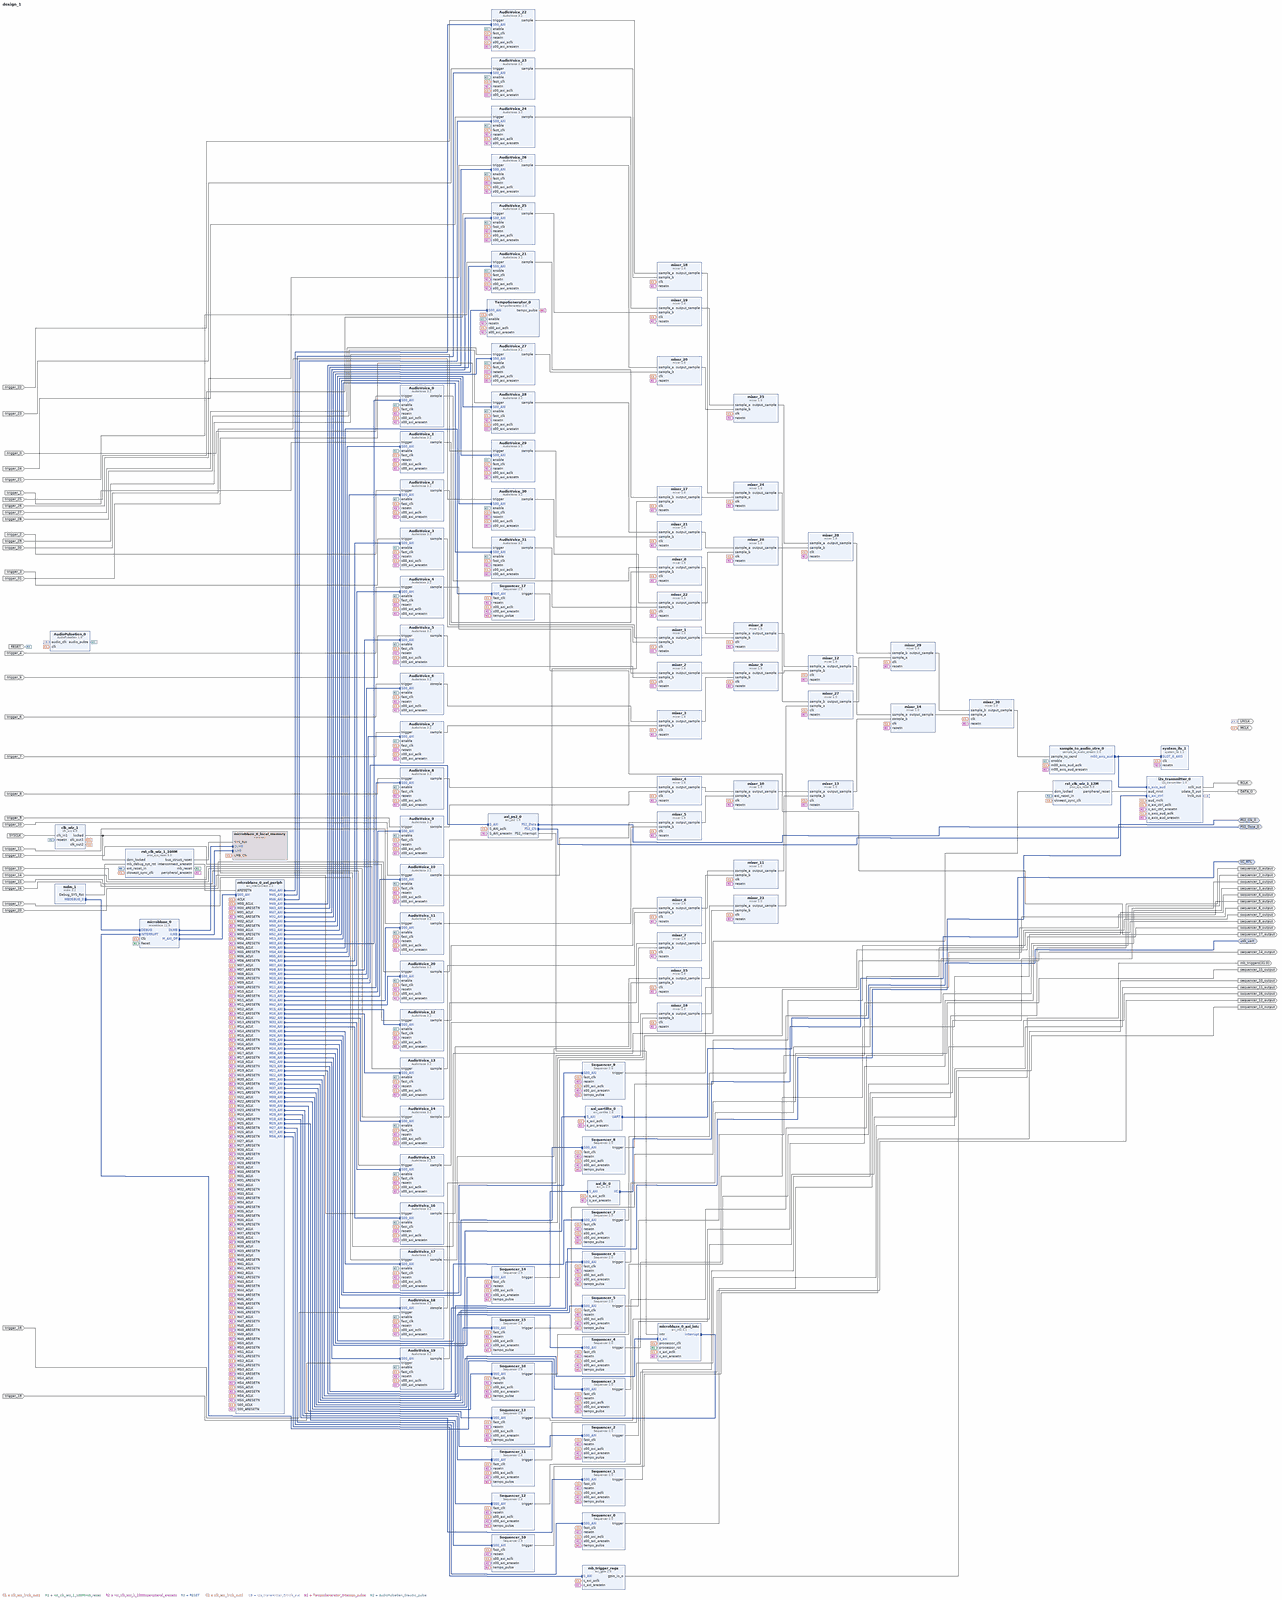
[diagram p0: block diagram of the top level, whole]
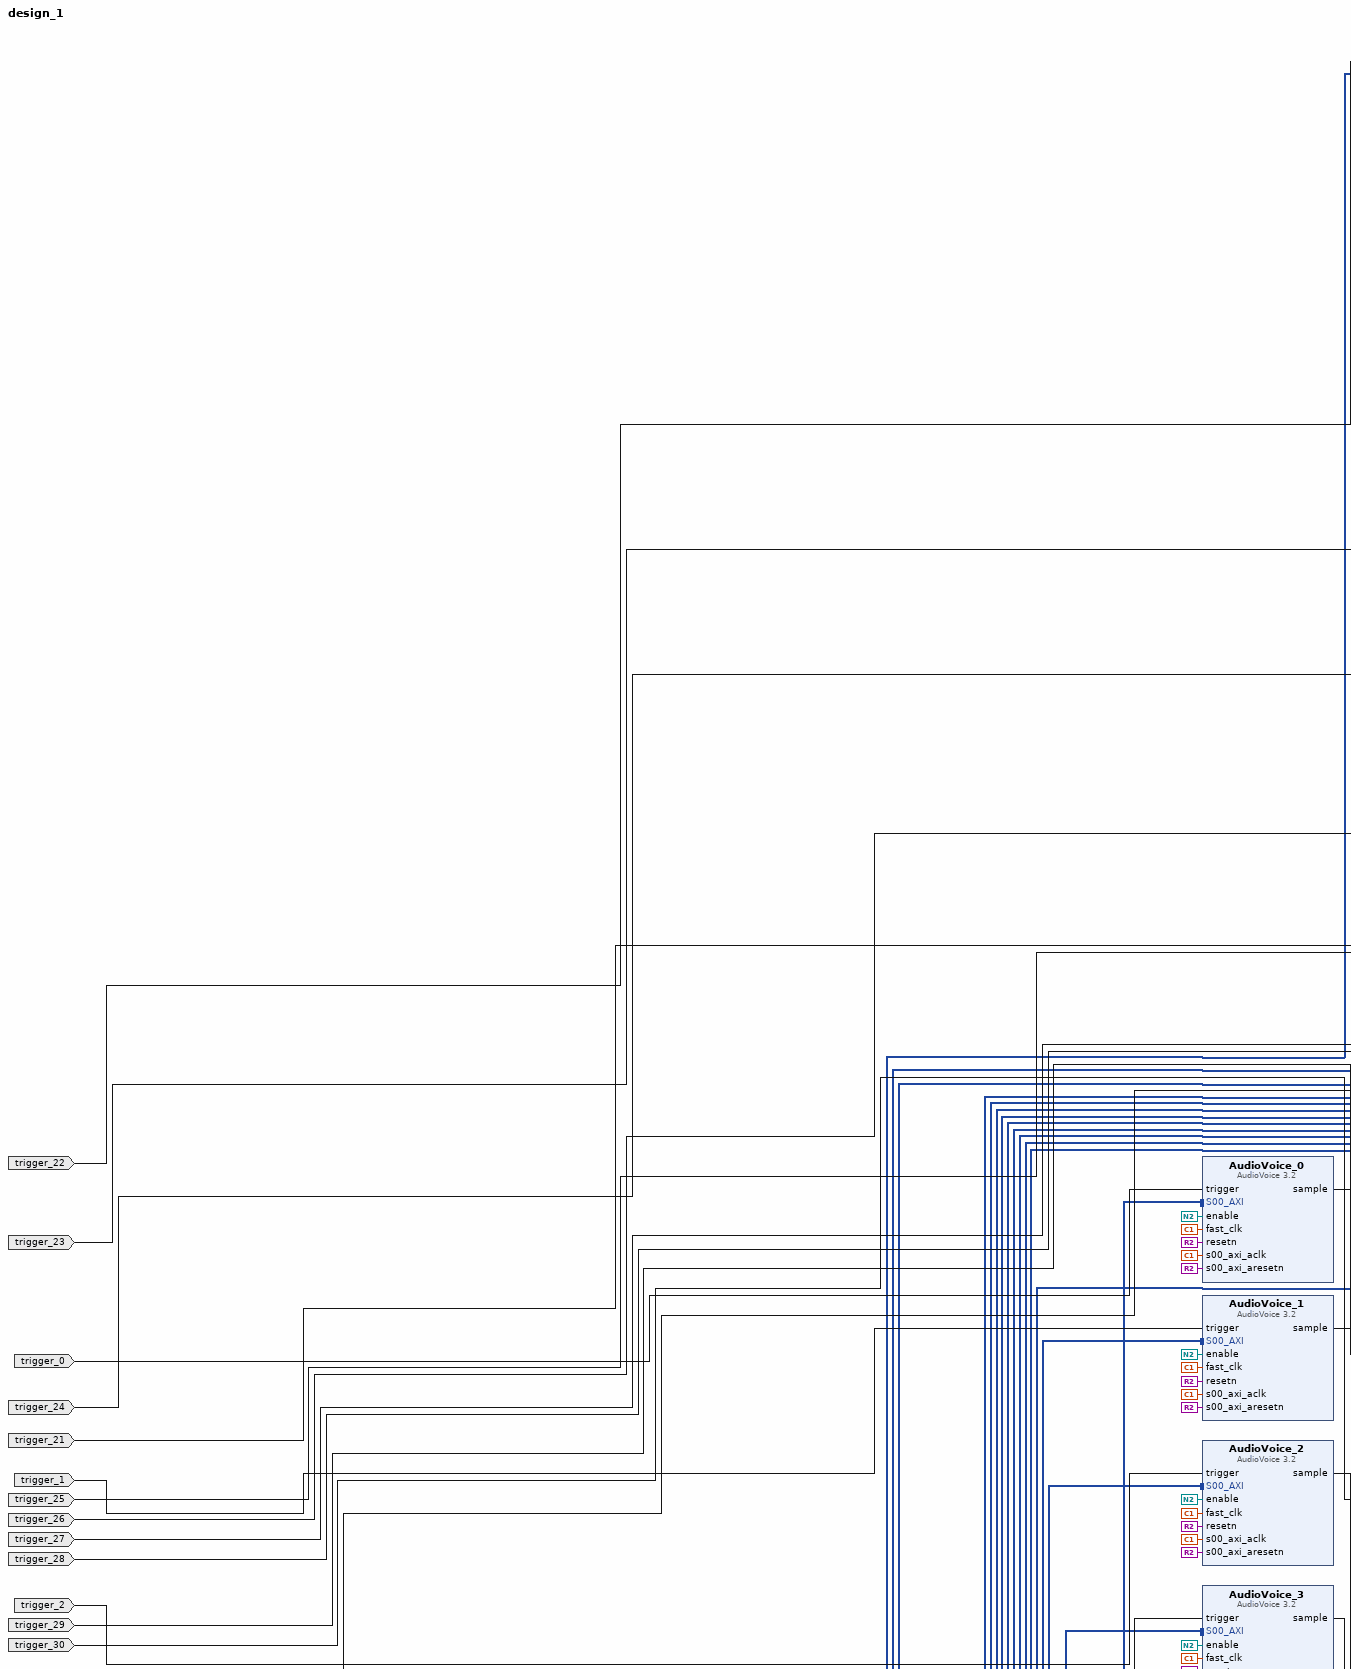
[diagram p1: block diagram of the top level, upper left part]
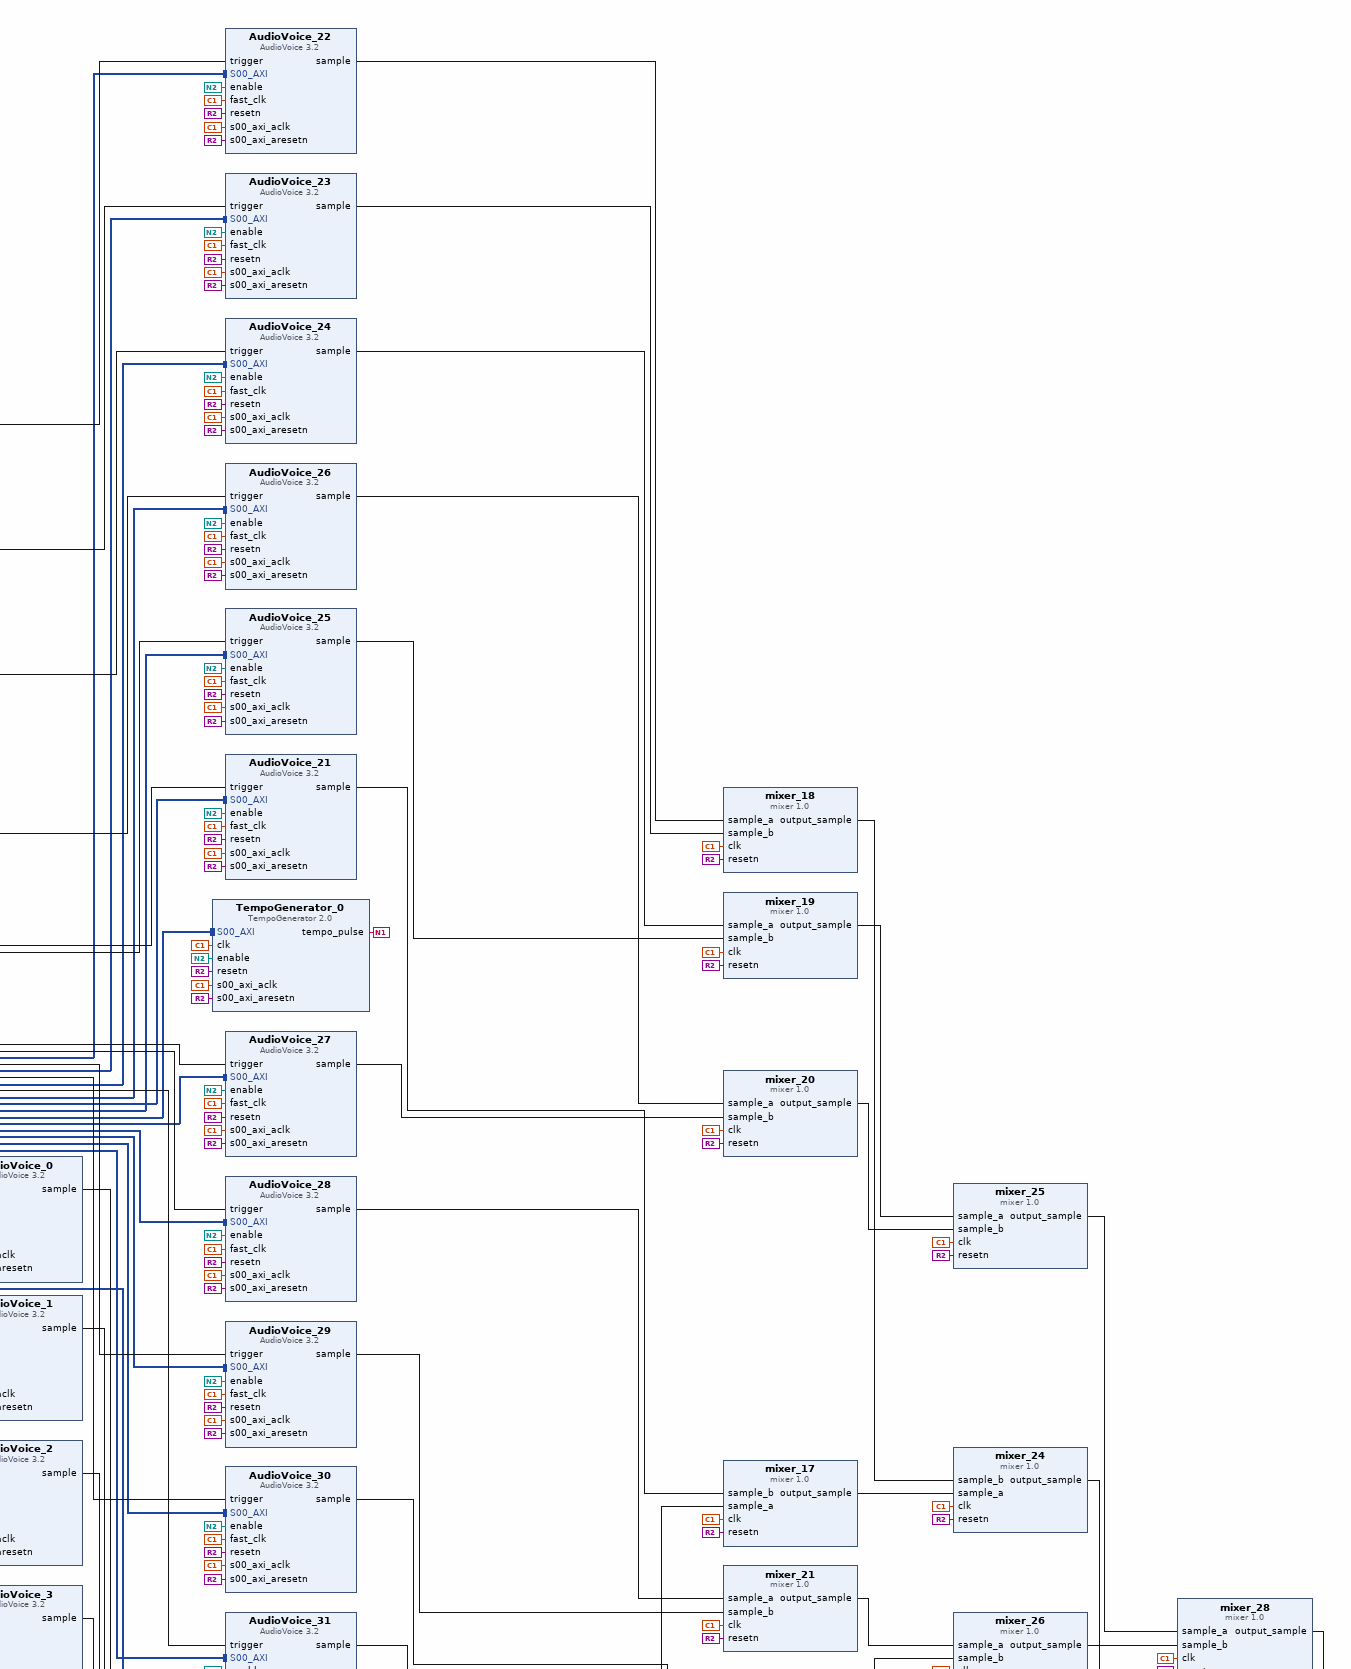
[diagram p2: block diagram of the top level, upper centre part]
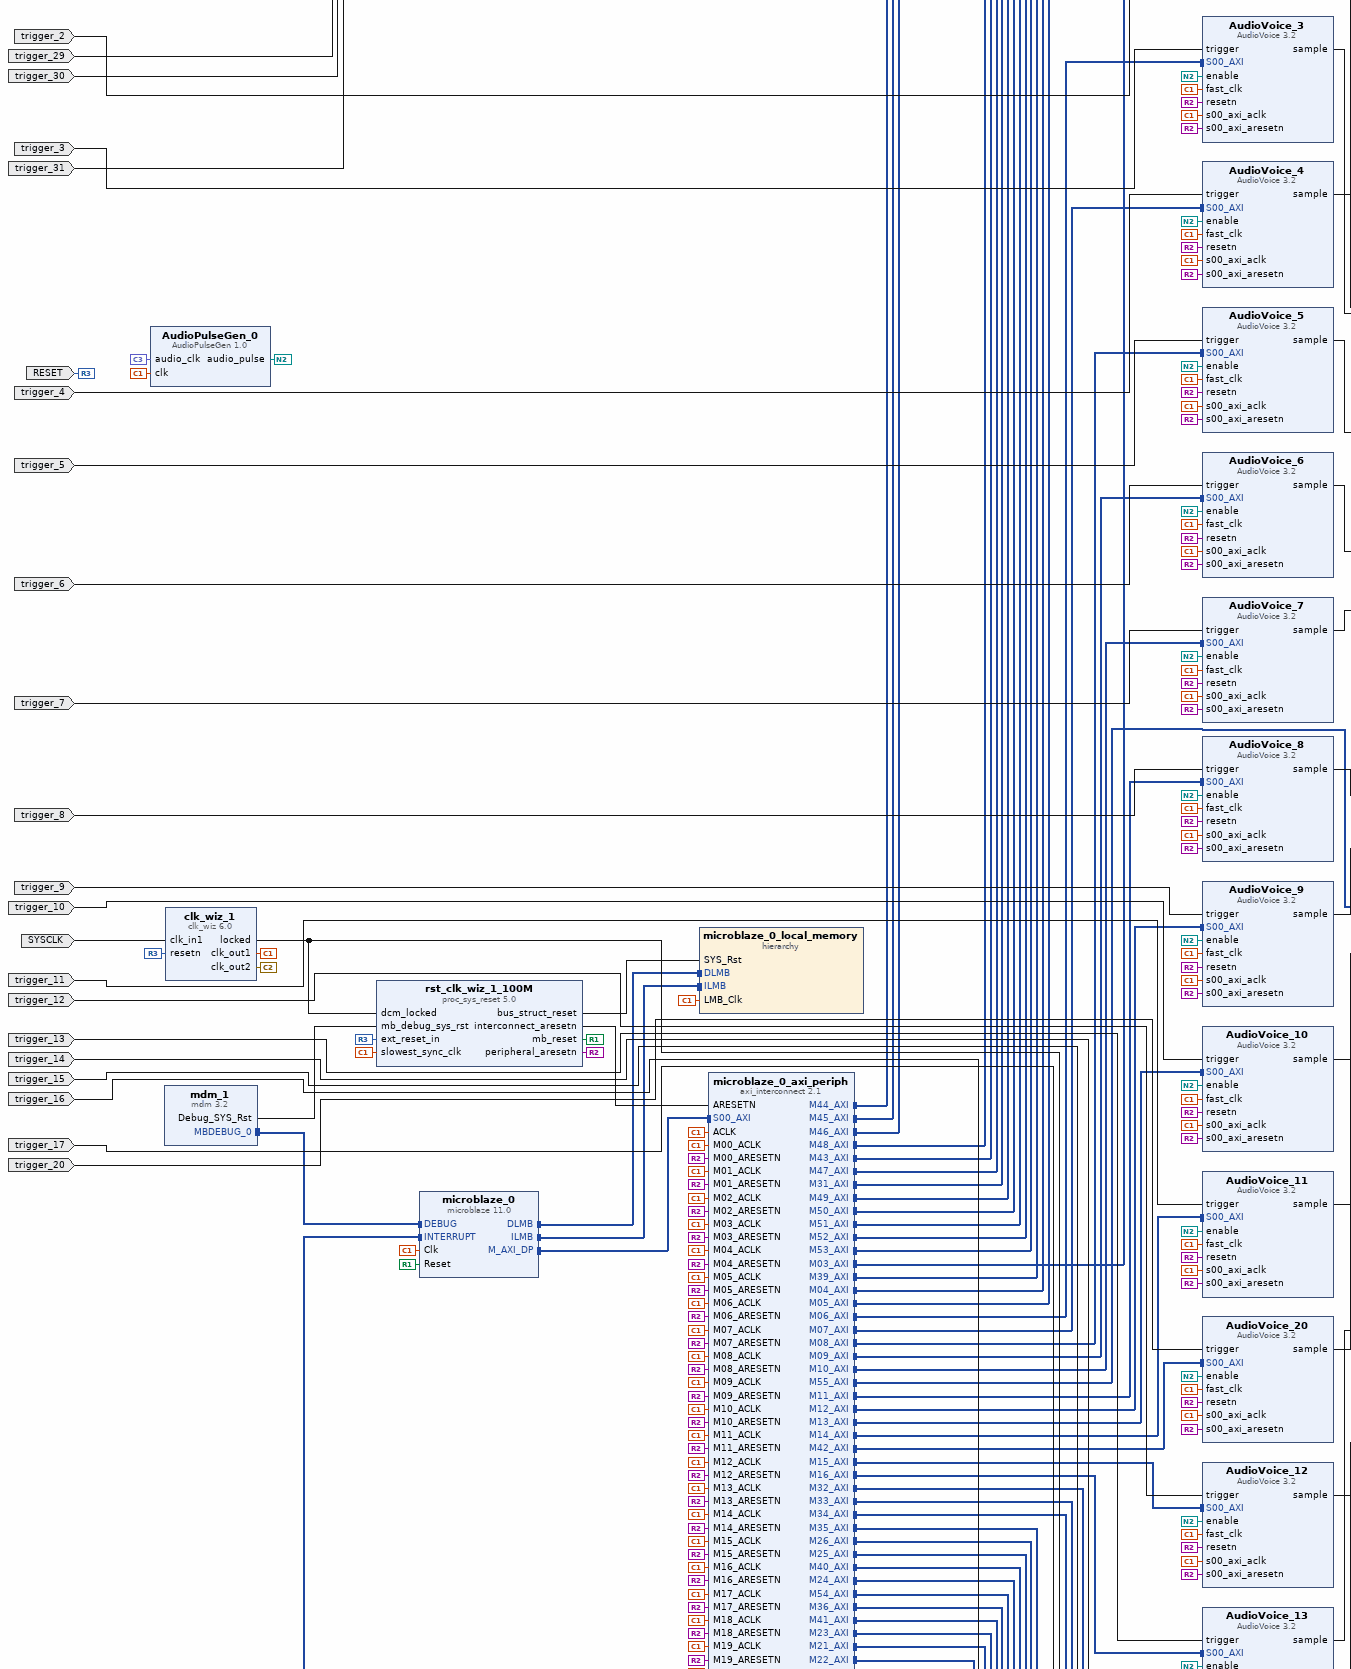
[diagram p3: block diagram of the top level, middle left part]
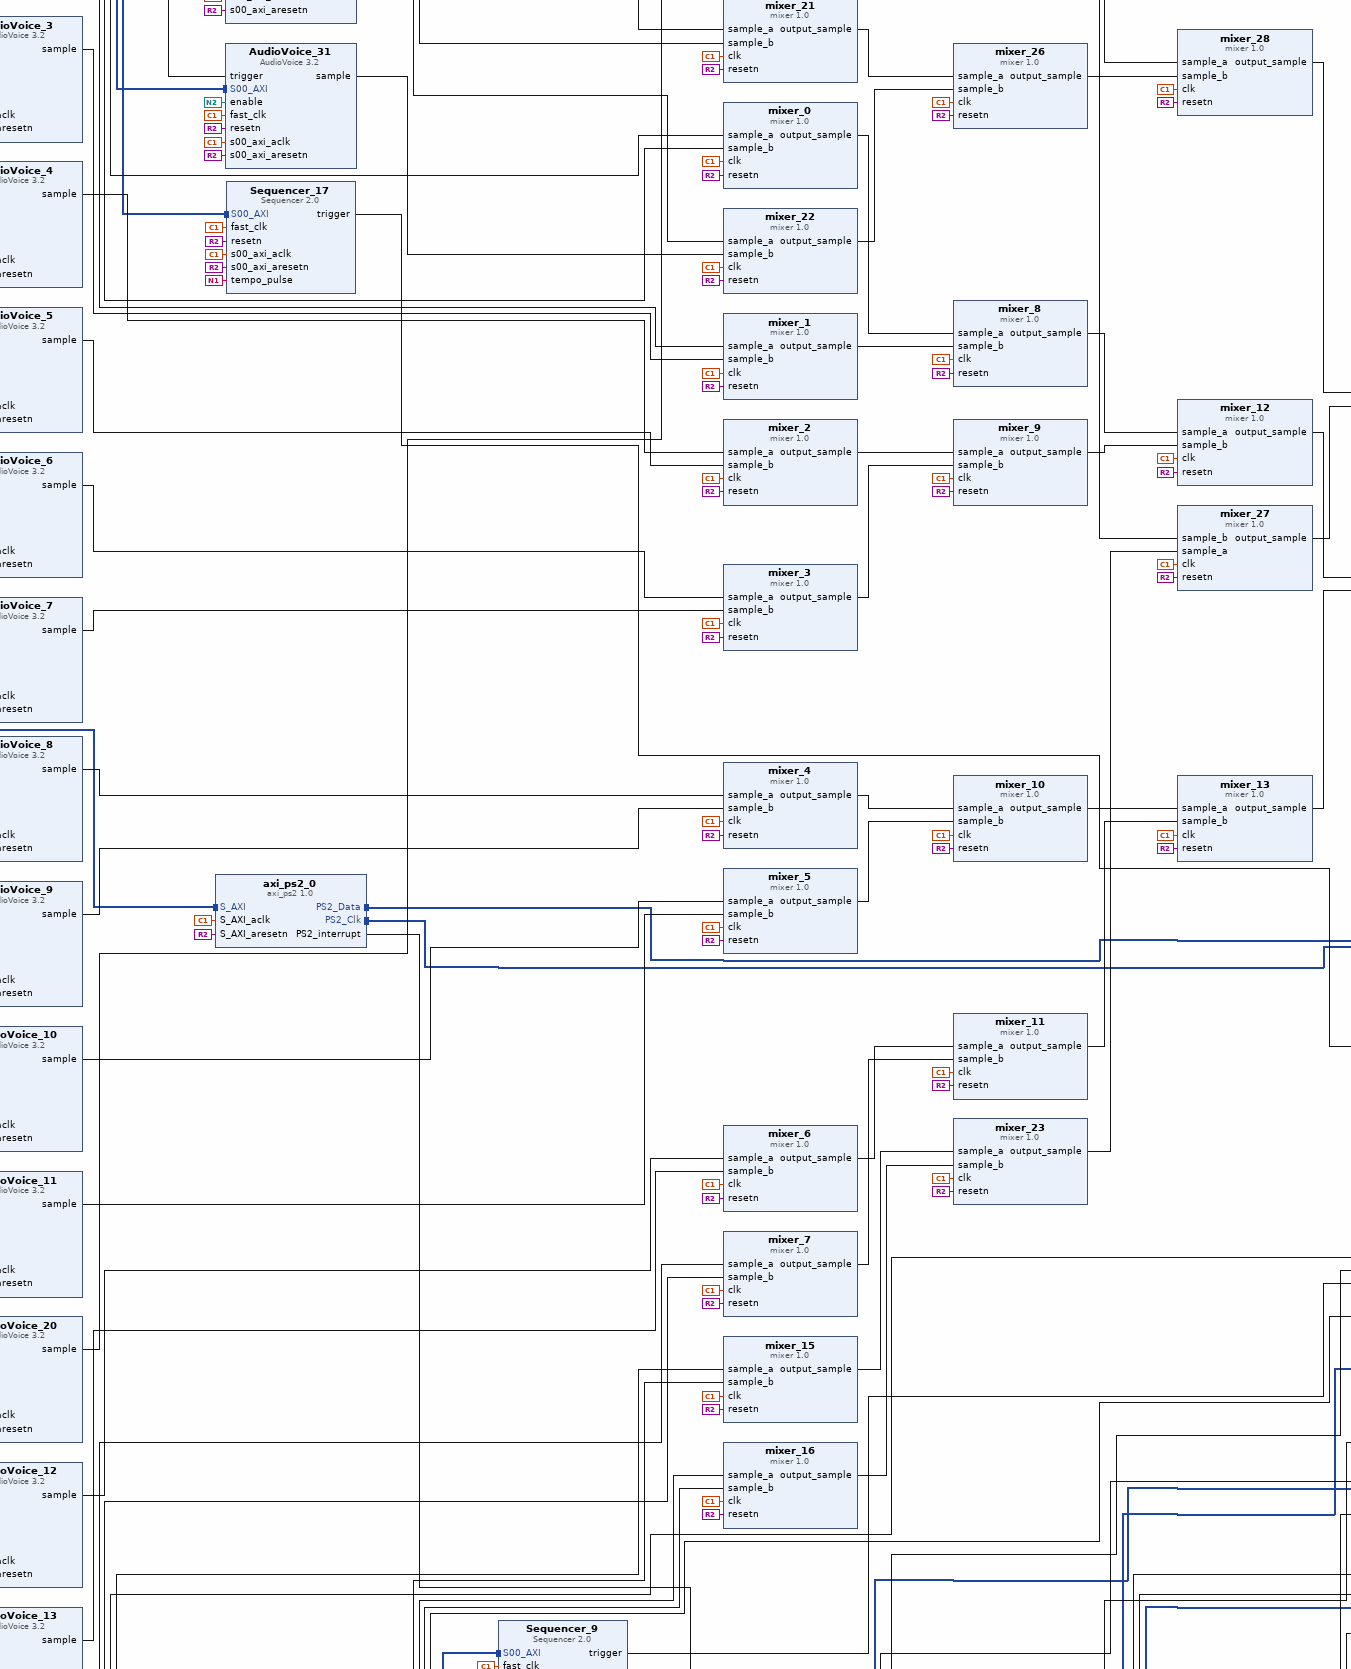
[diagram p4: block diagram of the top level, middle centre part]
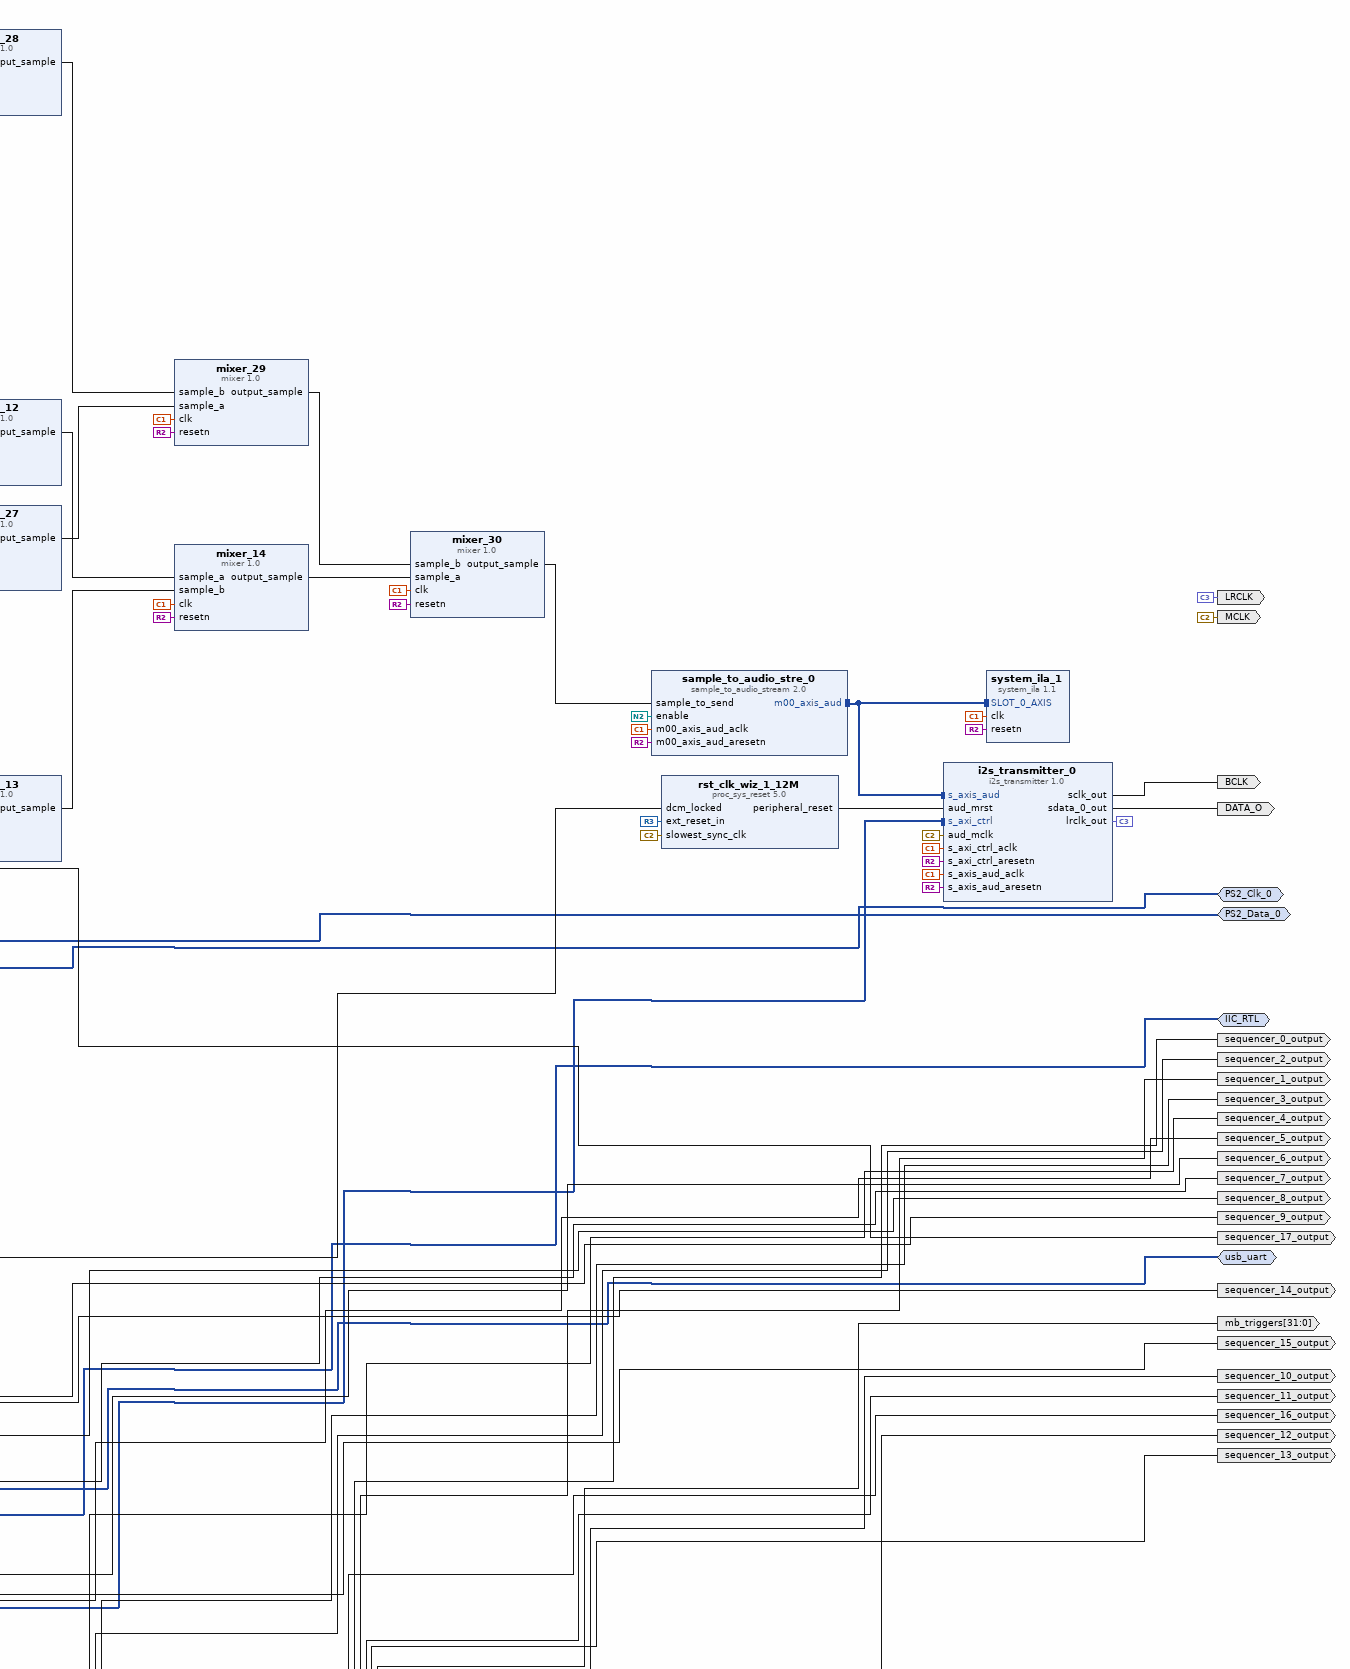
[diagram p5: block diagram of the top level, middle right part]
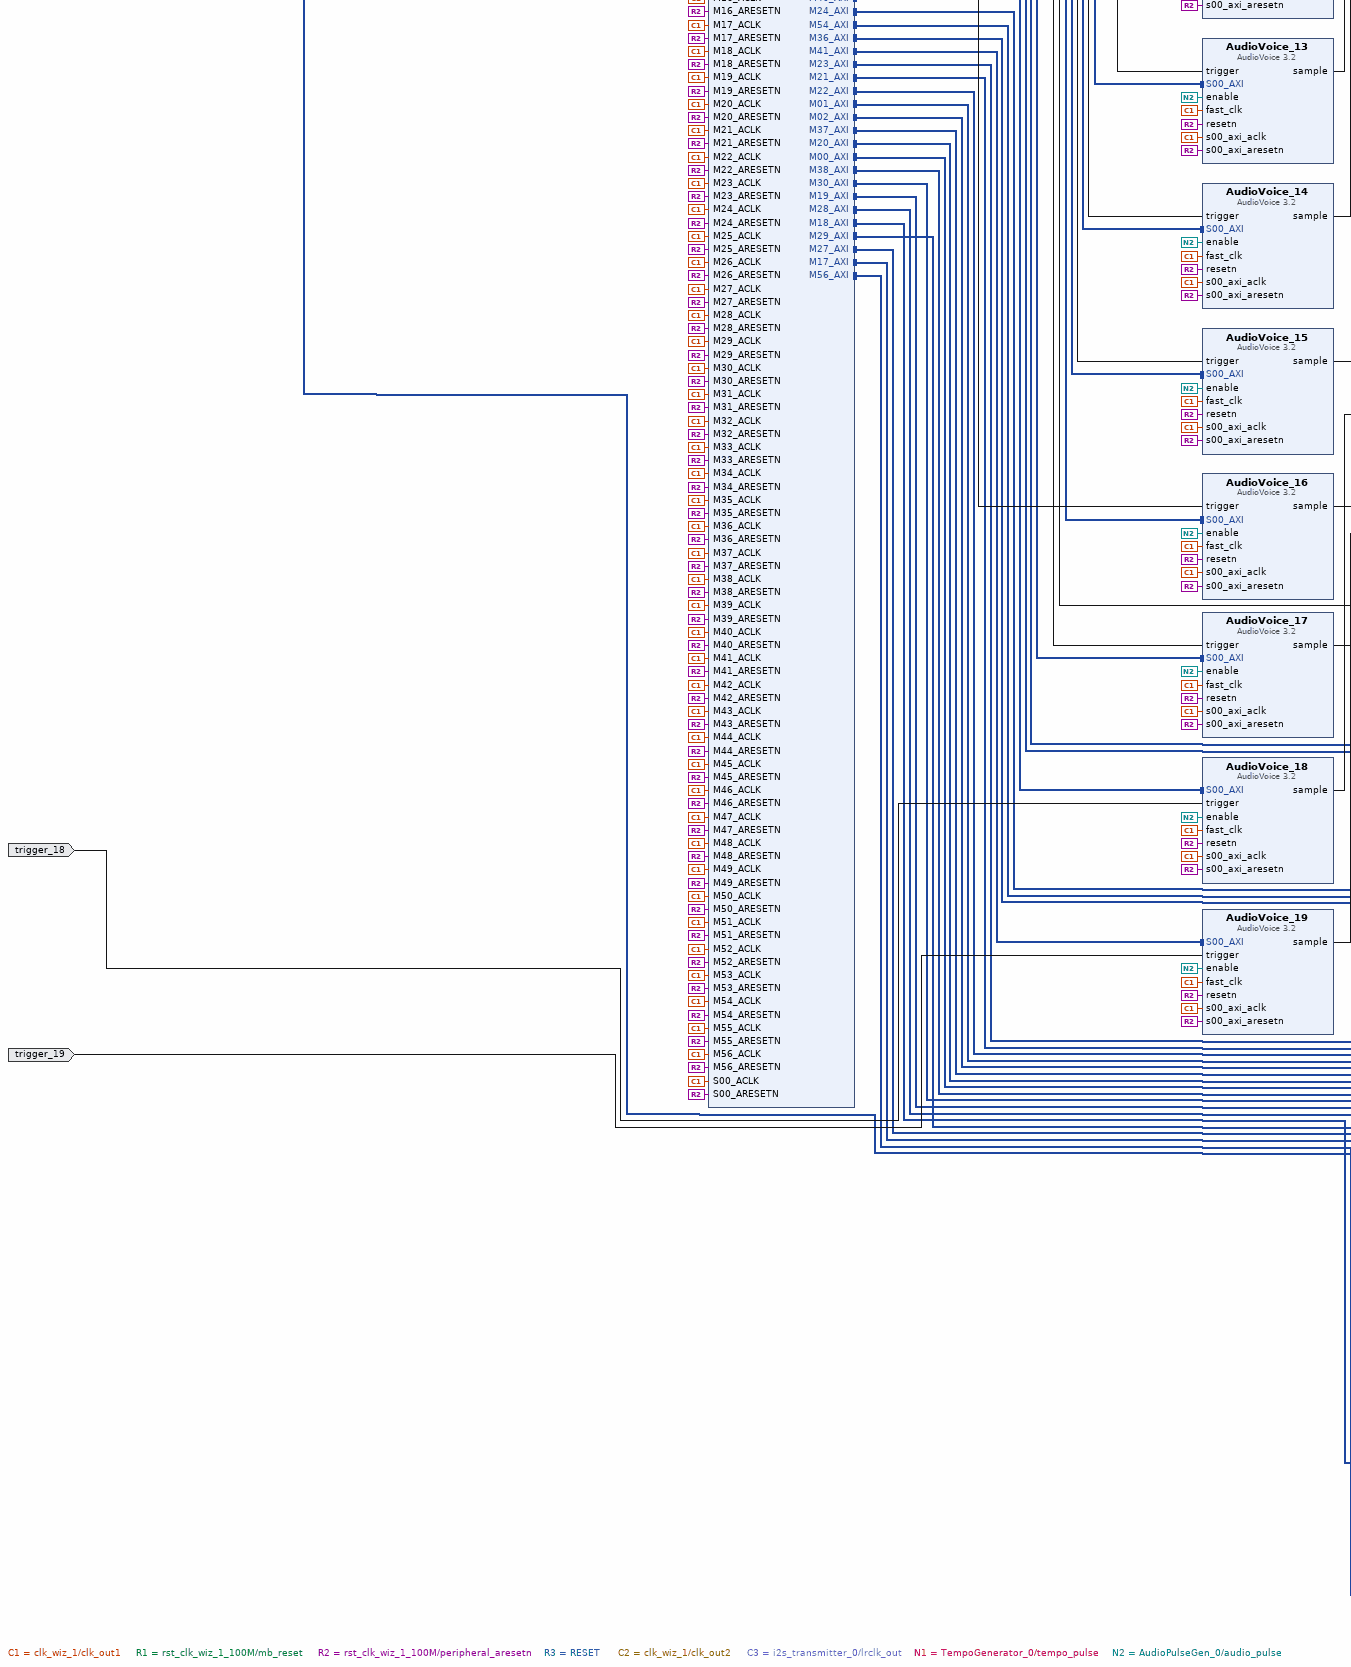
[diagram p6: block diagram of the top level, lower left part]
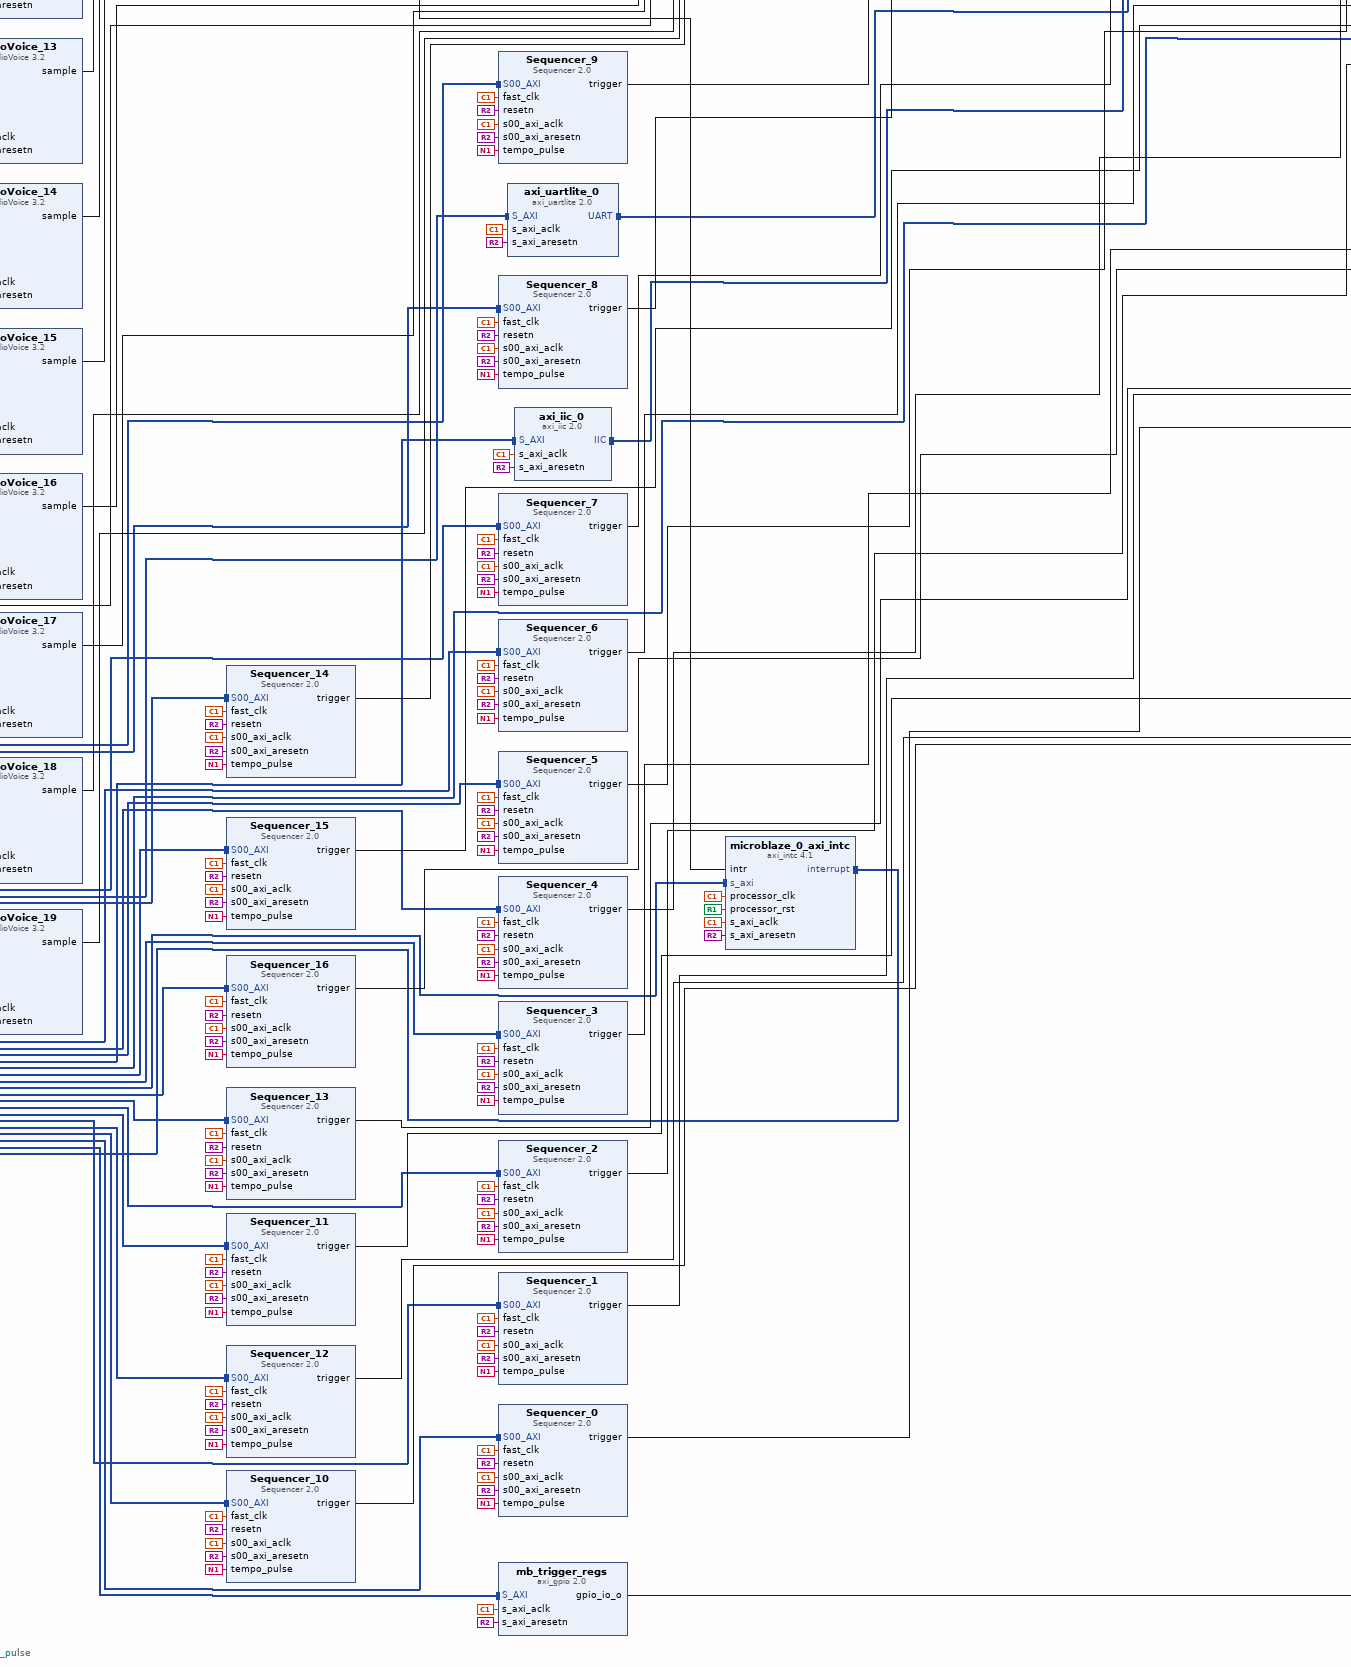
[diagram p7: block diagram of the top level, lower centre part]
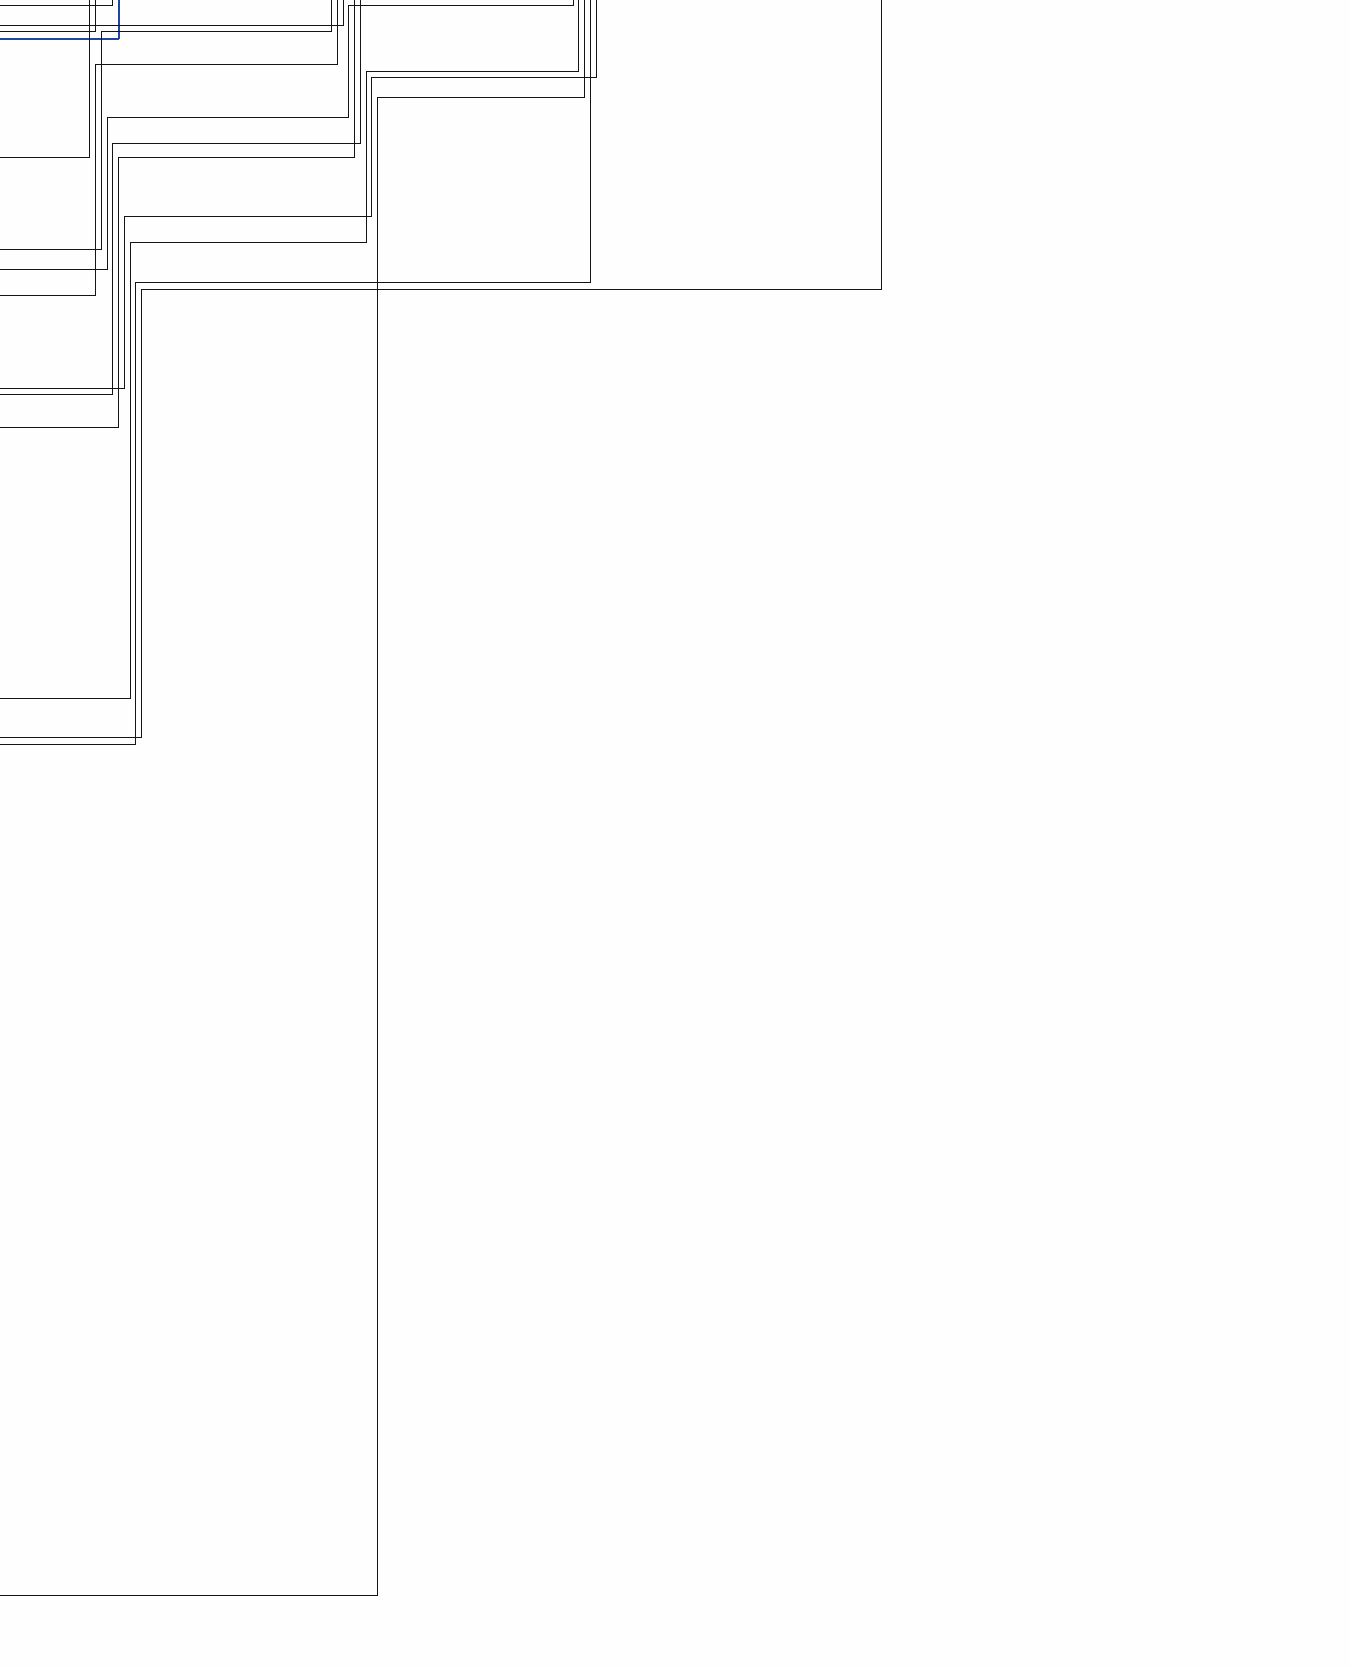
[diagram p8: block diagram of the top level, lower right part]
# Vivado block design design_1, xc7a200tsbg484-1, Vivado 2018.3.1
create_bd_design design_1

create_bd_intf_port -mode Master -vlnv xilinx.com:interface:iic_rtl:1.0 IIC_RTL
create_bd_intf_port -mode Master -vlnv xilinx.com:interface:uart_rtl:1.0 usb_uart
create_bd_intf_port -mode Master -vlnv xilinx.com:interface:gpio_rtl:1.0 PS2_Clk_0
create_bd_intf_port -mode Master -vlnv xilinx.com:interface:gpio_rtl:1.0 PS2_Data_0
create_bd_port -dir O DATA_O
create_bd_port -dir O LRCLK
create_bd_port -dir O BCLK
create_bd_port -dir O -type clk MCLK
create_bd_port -dir I -type clk SYSCLK
create_bd_port -dir I -type rst RESET
set_property -dict {CONFIG.POLARITY ACTIVE_LOW} [get_bd_ports RESET]
create_bd_port -dir O sequencer_0_output
create_bd_port -dir O sequencer_1_output
create_bd_port -dir O sequencer_2_output
create_bd_port -dir O sequencer_3_output
create_bd_port -dir O sequencer_4_output
create_bd_port -dir O sequencer_5_output
create_bd_port -dir O sequencer_6_output
create_bd_port -dir O sequencer_7_output
create_bd_port -dir O sequencer_8_output
create_bd_port -dir O sequencer_9_output
create_bd_port -dir O sequencer_10_output
create_bd_port -dir O sequencer_11_output
create_bd_port -dir O sequencer_12_output
create_bd_port -dir O sequencer_13_output
create_bd_port -dir I trigger_0
create_bd_port -dir I trigger_1
create_bd_port -dir I trigger_2
create_bd_port -dir I trigger_3
create_bd_port -dir I trigger_4
create_bd_port -dir I trigger_5
create_bd_port -dir I trigger_6
create_bd_port -dir I trigger_7
create_bd_port -dir I trigger_8
create_bd_port -dir I trigger_9
create_bd_port -dir I trigger_10
create_bd_port -dir I trigger_11
create_bd_port -dir I trigger_12
create_bd_port -dir I trigger_13
create_bd_port -dir I trigger_14
create_bd_port -dir I trigger_15
create_bd_port -dir I trigger_16
create_bd_port -dir I trigger_17
create_bd_port -dir O sequencer_14_output
create_bd_port -dir O sequencer_15_output
create_bd_port -dir O sequencer_16_output
create_bd_port -dir O sequencer_17_output
create_bd_port -dir I trigger_18
create_bd_port -dir I trigger_19
create_bd_port -dir I trigger_20
create_bd_port -dir I trigger_21
create_bd_port -dir I trigger_22
create_bd_port -dir I trigger_23
create_bd_port -dir I trigger_24
create_bd_port -dir I trigger_25
create_bd_port -dir I trigger_26
create_bd_port -dir I trigger_27
create_bd_port -dir I trigger_28
create_bd_port -dir I trigger_29
create_bd_port -dir I trigger_30
create_bd_port -dir I trigger_31
create_bd_port -dir O -from 31 -to 0 mb_triggers

create_bd_cell -type ip -vlnv xilinx.com:ip:microblaze:11.0 microblaze_0
set_property -dict {CONFIG.C_DEBUG_ENABLED 1 CONFIG.C_D_AXI 1 CONFIG.C_D_LMB 1 CONFIG.C_I_LMB 1} [get_bd_cells microblaze_0]
create_bd_cell -type hier microblaze_0_local_memory
create_bd_cell -type ip -vlnv xilinx.com:ip:axi_interconnect:2.1 microblaze_0_axi_periph
set_property -dict {CONFIG.NUM_MI 57} [get_bd_cells microblaze_0_axi_periph]
create_bd_cell -type ip -vlnv xilinx.com:ip:axi_intc:4.1 microblaze_0_axi_intc
set_property -dict {CONFIG.C_HAS_FAST 1} [get_bd_cells microblaze_0_axi_intc]
create_bd_cell -type ip -vlnv xilinx.com:ip:mdm:3.2 mdm_1
create_bd_cell -type ip -vlnv xilinx.com:ip:clk_wiz:6.0 clk_wiz_1
set_property -dict [list \
  CONFIG.CLKIN2_JITTER_PS 166.66 \
  CONFIG.CLKOUT1_JITTER 197.720 \
  CONFIG.CLKOUT1_PHASE_ERROR 157.495 \
  CONFIG.CLKOUT1_REQUESTED_OUT_FREQ 27.000 \
  CONFIG.CLKOUT2_JITTER 236.036 \
  CONFIG.CLKOUT2_PHASE_ERROR 157.495 \
  CONFIG.CLKOUT2_REQUESTED_OUT_FREQ 12.288 \
  CONFIG.CLKOUT2_USED true \
  CONFIG.CLK_IN1_BOARD_INTERFACE sys_clock \
  CONFIG.MMCM_CLKFBOUT_MULT_F 21.875 \
  CONFIG.MMCM_CLKIN2_PERIOD 10.000 \
  CONFIG.MMCM_CLKOUT0_DIVIDE_F 40.500 \
  CONFIG.MMCM_CLKOUT1_DIVIDE 89 \
  CONFIG.MMCM_DIVCLK_DIVIDE 2 \
  CONFIG.NUM_OUT_CLKS 2 \
  CONFIG.PRIM_SOURCE Single_ended_clock_capable_pin \
  CONFIG.RESET_BOARD_INTERFACE reset \
  CONFIG.RESET_PORT resetn \
  CONFIG.RESET_TYPE ACTIVE_LOW \
  CONFIG.SECONDARY_SOURCE Single_ended_clock_capable_pin \
  CONFIG.USE_INCLK_SWITCHOVER false \
] [get_bd_cells clk_wiz_1]
create_bd_cell -type ip -vlnv xilinx.com:ip:proc_sys_reset:5.0 rst_clk_wiz_1_100M
set_property -dict {CONFIG.RESET_BOARD_INTERFACE reset CONFIG.USE_BOARD_FLOW true} [get_bd_cells rst_clk_wiz_1_100M]
create_bd_cell -type ip -vlnv xilinx.com:ip:axi_iic:2.0 axi_iic_0
create_bd_cell -type ip -vlnv xilinx.com:ip:i2s_transmitter:1.0 i2s_transmitter_0
set_property -dict {CONFIG.C_DWIDTH 16} [get_bd_cells i2s_transmitter_0]
create_bd_cell -type ip -vlnv xilinx.com:ip:proc_sys_reset:5.0 rst_clk_wiz_1_12M
create_bd_cell -type ip -vlnv xilinx.com:ip:system_ila:1.1 system_ila_1
set_property -dict [list \
  CONFIG.C_MON_TYPE INTERFACE \
  CONFIG.C_NUM_MONITOR_SLOTS 1 \
  CONFIG.C_SLOT_0_APC_EN 1 \
  CONFIG.C_SLOT_0_AXI_DATA_SEL 1 \
  CONFIG.C_SLOT_0_AXI_TRIG_SEL 1 \
  CONFIG.C_SLOT_0_INTF_TYPE xilinx.com:interface:axis_rtl:1.0 \
] [get_bd_cells system_ila_1]
create_bd_cell -type ip -vlnv utoronto.ca:user:Sequencer:2.0 Sequencer_0
set_property -dict [list \
  CONFIG.C_SEQUENCE_DATA_WIDTH 32 \
  CONFIG.C_SEQUENCE_DEFAULT_VALUE 0x0 \
  CONFIG.C_SEQUENCE_LEN_DATA_WIDTH 6 \
  CONFIG.C_SEQUENCE_LEN_DEFAULT_VALUE 32 \
] [get_bd_cells Sequencer_0]
create_bd_cell -type ip -vlnv utoronto.ca:user:Sequencer:2.0 Sequencer_1
set_property -dict [list \
  CONFIG.C_SEQUENCE_DATA_WIDTH 32 \
  CONFIG.C_SEQUENCE_DEFAULT_VALUE 0x0 \
  CONFIG.C_SEQUENCE_LEN_DATA_WIDTH 6 \
  CONFIG.C_SEQUENCE_LEN_DEFAULT_VALUE 32 \
] [get_bd_cells Sequencer_1]
create_bd_cell -type ip -vlnv utoronto.ca:user:Sequencer:2.0 Sequencer_14
set_property -dict [list \
  CONFIG.C_SEQUENCE_DATA_WIDTH 32 \
  CONFIG.C_SEQUENCE_DEFAULT_VALUE 0x0 \
  CONFIG.C_SEQUENCE_LEN_DATA_WIDTH 6 \
  CONFIG.C_SEQUENCE_LEN_DEFAULT_VALUE 32 \
] [get_bd_cells Sequencer_14]
create_bd_cell -type ip -vlnv utoronto.ca:user:Sequencer:2.0 Sequencer_11
set_property -dict [list \
  CONFIG.C_SEQUENCE_DATA_WIDTH 32 \
  CONFIG.C_SEQUENCE_DEFAULT_VALUE 0x0 \
  CONFIG.C_SEQUENCE_LEN_DATA_WIDTH 6 \
  CONFIG.C_SEQUENCE_LEN_DEFAULT_VALUE 32 \
] [get_bd_cells Sequencer_11]
create_bd_cell -type ip -vlnv utoronto.ca:user:Sequencer:2.0 Sequencer_12
set_property -dict [list \
  CONFIG.C_SEQUENCE_DATA_WIDTH 32 \
  CONFIG.C_SEQUENCE_DEFAULT_VALUE 0x0 \
  CONFIG.C_SEQUENCE_LEN_DATA_WIDTH 6 \
  CONFIG.C_SEQUENCE_LEN_DEFAULT_VALUE 32 \
] [get_bd_cells Sequencer_12]
create_bd_cell -type ip -vlnv utoronto.ca:user:Sequencer:2.0 Sequencer_13
set_property -dict [list \
  CONFIG.C_SEQUENCE_DATA_WIDTH 32 \
  CONFIG.C_SEQUENCE_DEFAULT_VALUE 0x0 \
  CONFIG.C_SEQUENCE_LEN_DATA_WIDTH 6 \
  CONFIG.C_SEQUENCE_LEN_DEFAULT_VALUE 32 \
] [get_bd_cells Sequencer_13]
create_bd_cell -type ip -vlnv utoronto.ca:user:Sequencer:2.0 Sequencer_15
set_property -dict [list \
  CONFIG.C_SEQUENCE_DATA_WIDTH 32 \
  CONFIG.C_SEQUENCE_DEFAULT_VALUE 0x0 \
  CONFIG.C_SEQUENCE_LEN_DATA_WIDTH 6 \
  CONFIG.C_SEQUENCE_LEN_DEFAULT_VALUE 32 \
] [get_bd_cells Sequencer_15]
create_bd_cell -type ip -vlnv utoronto.ca:user:Sequencer:2.0 Sequencer_16
set_property -dict [list \
  CONFIG.C_SEQUENCE_DATA_WIDTH 32 \
  CONFIG.C_SEQUENCE_DEFAULT_VALUE 0x0 \
  CONFIG.C_SEQUENCE_LEN_DATA_WIDTH 6 \
  CONFIG.C_SEQUENCE_LEN_DEFAULT_VALUE 32 \
] [get_bd_cells Sequencer_16]
create_bd_cell -type ip -vlnv utoronto.ca:user:Sequencer:2.0 Sequencer_17
set_property -dict [list \
  CONFIG.C_SEQUENCE_DATA_WIDTH 32 \
  CONFIG.C_SEQUENCE_DEFAULT_VALUE 0x0 \
  CONFIG.C_SEQUENCE_LEN_DATA_WIDTH 6 \
  CONFIG.C_SEQUENCE_LEN_DEFAULT_VALUE 32 \
] [get_bd_cells Sequencer_17]
create_bd_cell -type ip -vlnv utoronto.ca:user:Sequencer:2.0 Sequencer_2
set_property -dict [list \
  CONFIG.C_SEQUENCE_DATA_WIDTH 32 \
  CONFIG.C_SEQUENCE_DEFAULT_VALUE 0x0 \
  CONFIG.C_SEQUENCE_LEN_DATA_WIDTH 6 \
  CONFIG.C_SEQUENCE_LEN_DEFAULT_VALUE 32 \
] [get_bd_cells Sequencer_2]
create_bd_cell -type ip -vlnv utoronto.ca:user:Sequencer:2.0 Sequencer_3
set_property -dict [list \
  CONFIG.C_SEQUENCE_DATA_WIDTH 32 \
  CONFIG.C_SEQUENCE_DEFAULT_VALUE 0x0 \
  CONFIG.C_SEQUENCE_LEN_DATA_WIDTH 6 \
  CONFIG.C_SEQUENCE_LEN_DEFAULT_VALUE 32 \
] [get_bd_cells Sequencer_3]
create_bd_cell -type ip -vlnv utoronto.ca:user:Sequencer:2.0 Sequencer_4
set_property -dict [list \
  CONFIG.C_SEQUENCE_DATA_WIDTH 32 \
  CONFIG.C_SEQUENCE_DEFAULT_VALUE 0x0 \
  CONFIG.C_SEQUENCE_LEN_DATA_WIDTH 6 \
  CONFIG.C_SEQUENCE_LEN_DEFAULT_VALUE 32 \
] [get_bd_cells Sequencer_4]
create_bd_cell -type ip -vlnv utoronto.ca:user:Sequencer:2.0 Sequencer_5
set_property -dict [list \
  CONFIG.C_SEQUENCE_DATA_WIDTH 32 \
  CONFIG.C_SEQUENCE_DEFAULT_VALUE 0x0 \
  CONFIG.C_SEQUENCE_LEN_DATA_WIDTH 6 \
  CONFIG.C_SEQUENCE_LEN_DEFAULT_VALUE 32 \
] [get_bd_cells Sequencer_5]
create_bd_cell -type ip -vlnv utoronto.ca:user:Sequencer:2.0 Sequencer_8
set_property -dict [list \
  CONFIG.C_SEQUENCE_DATA_WIDTH 32 \
  CONFIG.C_SEQUENCE_DEFAULT_VALUE 0x0 \
  CONFIG.C_SEQUENCE_LEN_DATA_WIDTH 6 \
  CONFIG.C_SEQUENCE_LEN_DEFAULT_VALUE 32 \
] [get_bd_cells Sequencer_8]
create_bd_cell -type ip -vlnv utoronto.ca:user:Sequencer:2.0 Sequencer_6
set_property -dict [list \
  CONFIG.C_SEQUENCE_DATA_WIDTH 32 \
  CONFIG.C_SEQUENCE_DEFAULT_VALUE 0x0 \
  CONFIG.C_SEQUENCE_LEN_DATA_WIDTH 6 \
  CONFIG.C_SEQUENCE_LEN_DEFAULT_VALUE 32 \
] [get_bd_cells Sequencer_6]
create_bd_cell -type ip -vlnv utoronto.ca:user:Sequencer:2.0 Sequencer_7
set_property -dict [list \
  CONFIG.C_SEQUENCE_DATA_WIDTH 32 \
  CONFIG.C_SEQUENCE_DEFAULT_VALUE 0x0 \
  CONFIG.C_SEQUENCE_LEN_DATA_WIDTH 6 \
  CONFIG.C_SEQUENCE_LEN_DEFAULT_VALUE 32 \
] [get_bd_cells Sequencer_7]
create_bd_cell -type ip -vlnv utoronto.ca:user:Sequencer:2.0 Sequencer_9
set_property -dict [list \
  CONFIG.C_SEQUENCE_DATA_WIDTH 32 \
  CONFIG.C_SEQUENCE_DEFAULT_VALUE 0x0 \
  CONFIG.C_SEQUENCE_LEN_DATA_WIDTH 6 \
  CONFIG.C_SEQUENCE_LEN_DEFAULT_VALUE 32 \
] [get_bd_cells Sequencer_9]
create_bd_cell -type ip -vlnv utoronto.ca:user:Sequencer:2.0 Sequencer_10
set_property -dict [list \
  CONFIG.C_SEQUENCE_DATA_WIDTH 32 \
  CONFIG.C_SEQUENCE_DEFAULT_VALUE 0x0 \
  CONFIG.C_SEQUENCE_LEN_DATA_WIDTH 6 \
  CONFIG.C_SEQUENCE_LEN_DEFAULT_VALUE 32 \
] [get_bd_cells Sequencer_10]
create_bd_cell -type ip -vlnv utoronto.ca:user:AudioVoice:3.2 AudioVoice_0
set_property -dict {CONFIG.C_PITCH_DEFAULT 0x00B7} [get_bd_cells AudioVoice_0]
create_bd_cell -type ip -vlnv utoronto.ca:user:AudioVoice:3.2 AudioVoice_12
set_property -dict {CONFIG.C_PITCH_DEFAULT 0x005B} [get_bd_cells AudioVoice_12]
create_bd_cell -type ip -vlnv utoronto.ca:user:AudioVoice:3.2 AudioVoice_13
set_property -dict {CONFIG.C_PITCH_DEFAULT 0x0056} [get_bd_cells AudioVoice_13]
create_bd_cell -type ip -vlnv utoronto.ca:user:AudioVoice:3.2 AudioVoice_14
set_property -dict {CONFIG.C_PITCH_DEFAULT 0x0056} [get_bd_cells AudioVoice_14]
create_bd_cell -type ip -vlnv utoronto.ca:user:AudioVoice:3.2 AudioVoice_15
set_property -dict {CONFIG.C_PITCH_DEFAULT 0x0056} [get_bd_cells AudioVoice_15]
create_bd_cell -type ip -vlnv utoronto.ca:user:AudioVoice:3.2 AudioVoice_16
set_property -dict {CONFIG.C_PITCH_DEFAULT 0x0056} [get_bd_cells AudioVoice_16]
create_bd_cell -type ip -vlnv utoronto.ca:user:AudioVoice:3.2 AudioVoice_17
set_property -dict {CONFIG.C_PITCH_DEFAULT 0x0056} [get_bd_cells AudioVoice_17]
create_bd_cell -type ip -vlnv utoronto.ca:user:AudioVoice:3.2 AudioVoice_1
set_property -dict {CONFIG.C_PITCH_DEFAULT 0x00AD} [get_bd_cells AudioVoice_1]
create_bd_cell -type ip -vlnv utoronto.ca:user:AudioVoice:3.2 AudioVoice_2
set_property -dict {CONFIG.C_PITCH_DEFAULT 0x00A3} [get_bd_cells AudioVoice_2]
create_bd_cell -type ip -vlnv utoronto.ca:user:AudioVoice:3.2 AudioVoice_3
set_property -dict {CONFIG.C_PITCH_DEFAULT 0x009A} [get_bd_cells AudioVoice_3]
create_bd_cell -type ip -vlnv utoronto.ca:user:AudioVoice:3.2 AudioVoice_4
set_property -dict {CONFIG.C_PITCH_DEFAULT 0x0091} [get_bd_cells AudioVoice_4]
create_bd_cell -type ip -vlnv utoronto.ca:user:AudioVoice:3.2 AudioVoice_6
set_property -dict {CONFIG.C_PITCH_DEFAULT 0x0081} [get_bd_cells AudioVoice_6]
create_bd_cell -type ip -vlnv utoronto.ca:user:AudioVoice:3.2 AudioVoice_5
set_property -dict {CONFIG.C_PITCH_DEFAULT 0x0089} [get_bd_cells AudioVoice_5]
create_bd_cell -type ip -vlnv utoronto.ca:user:AudioVoice:3.2 AudioVoice_7
set_property -dict {CONFIG.C_PITCH_DEFAULT 0x007A} [get_bd_cells AudioVoice_7]
create_bd_cell -type ip -vlnv utoronto.ca:user:AudioVoice:3.2 AudioVoice_8
set_property -dict {CONFIG.C_PITCH_DEFAULT 0x0073} [get_bd_cells AudioVoice_8]
create_bd_cell -type ip -vlnv utoronto.ca:user:AudioVoice:3.2 AudioVoice_9
set_property -dict {CONFIG.C_PITCH_DEFAULT 0x006D} [get_bd_cells AudioVoice_9]
create_bd_cell -type ip -vlnv utoronto.ca:user:AudioVoice:3.2 AudioVoice_10
set_property -dict {CONFIG.C_PITCH_DEFAULT 0x0066} [get_bd_cells AudioVoice_10]
create_bd_cell -type ip -vlnv utoronto.ca:user:AudioVoice:3.2 AudioVoice_11
set_property -dict {CONFIG.C_PITCH_DEFAULT 0x0061} [get_bd_cells AudioVoice_11]
create_bd_cell -type ip -vlnv utoronto.ca:user:TempoGenerator:2.0 TempoGenerator_0
create_bd_cell -type ip -vlnv utoronto.ca:user:sample_to_audio_stream:2.0 sample_to_audio_stre_0
create_bd_cell -type ip -vlnv utoronto.ca:user:AudioPulseGen:1.0 AudioPulseGen_0
create_bd_cell -type ip -vlnv utoronto.ca:user:mixer:1.0 mixer_0
set_property -dict {CONFIG.MODE true} [get_bd_cells mixer_0]
create_bd_cell -type ip -vlnv utoronto.ca:user:mixer:1.0 mixer_1
set_property -dict {CONFIG.MODE true} [get_bd_cells mixer_1]
create_bd_cell -type ip -vlnv utoronto.ca:user:mixer:1.0 mixer_2
set_property -dict {CONFIG.MODE true} [get_bd_cells mixer_2]
create_bd_cell -type ip -vlnv utoronto.ca:user:mixer:1.0 mixer_3
set_property -dict {CONFIG.MODE true} [get_bd_cells mixer_3]
create_bd_cell -type ip -vlnv utoronto.ca:user:mixer:1.0 mixer_4
set_property -dict {CONFIG.MODE true} [get_bd_cells mixer_4]
create_bd_cell -type ip -vlnv utoronto.ca:user:mixer:1.0 mixer_5
set_property -dict {CONFIG.MODE true} [get_bd_cells mixer_5]
create_bd_cell -type ip -vlnv utoronto.ca:user:mixer:1.0 mixer_6
set_property -dict {CONFIG.MODE true} [get_bd_cells mixer_6]
create_bd_cell -type ip -vlnv utoronto.ca:user:mixer:1.0 mixer_7
set_property -dict {CONFIG.MODE true} [get_bd_cells mixer_7]
create_bd_cell -type ip -vlnv utoronto.ca:user:mixer:1.0 mixer_8
set_property -dict {CONFIG.MODE true} [get_bd_cells mixer_8]
create_bd_cell -type ip -vlnv utoronto.ca:user:mixer:1.0 mixer_9
set_property -dict {CONFIG.MODE true} [get_bd_cells mixer_9]
create_bd_cell -type ip -vlnv utoronto.ca:user:mixer:1.0 mixer_10
set_property -dict {CONFIG.MODE true} [get_bd_cells mixer_10]
create_bd_cell -type ip -vlnv utoronto.ca:user:mixer:1.0 mixer_11
set_property -dict {CONFIG.MODE true} [get_bd_cells mixer_11]
create_bd_cell -type ip -vlnv utoronto.ca:user:mixer:1.0 mixer_12
set_property -dict {CONFIG.MODE true} [get_bd_cells mixer_12]
create_bd_cell -type ip -vlnv utoronto.ca:user:mixer:1.0 mixer_13
set_property -dict {CONFIG.MODE true} [get_bd_cells mixer_13]
create_bd_cell -type ip -vlnv utoronto.ca:user:mixer:1.0 mixer_14
set_property -dict {CONFIG.MODE true} [get_bd_cells mixer_14]
create_bd_cell -type ip -vlnv utoronto.ca:user:AudioVoice:3.2 AudioVoice_18
set_property -dict {CONFIG.C_PITCH_DEFAULT 0x0056} [get_bd_cells AudioVoice_18]
create_bd_cell -type ip -vlnv utoronto.ca:user:AudioVoice:3.2 AudioVoice_19
set_property -dict {CONFIG.C_PITCH_DEFAULT 0x0056} [get_bd_cells AudioVoice_19]
create_bd_cell -type ip -vlnv utoronto.ca:user:AudioVoice:3.2 AudioVoice_20
set_property -dict {CONFIG.C_PITCH_DEFAULT 0x0056} [get_bd_cells AudioVoice_20]
create_bd_cell -type ip -vlnv utoronto.ca:user:AudioVoice:3.2 AudioVoice_21
set_property -dict {CONFIG.C_PITCH_DEFAULT 0x0056} [get_bd_cells AudioVoice_21]
create_bd_cell -type ip -vlnv utoronto.ca:user:AudioVoice:3.2 AudioVoice_22
set_property -dict {CONFIG.C_PITCH_DEFAULT 0x0056} [get_bd_cells AudioVoice_22]
create_bd_cell -type ip -vlnv utoronto.ca:user:AudioVoice:3.2 AudioVoice_23
set_property -dict {CONFIG.C_PITCH_DEFAULT 0x0056} [get_bd_cells AudioVoice_23]
create_bd_cell -type ip -vlnv utoronto.ca:user:AudioVoice:3.2 AudioVoice_24
set_property -dict {CONFIG.C_PITCH_DEFAULT 0x0056} [get_bd_cells AudioVoice_24]
create_bd_cell -type ip -vlnv utoronto.ca:user:AudioVoice:3.2 AudioVoice_25
set_property -dict {CONFIG.C_PITCH_DEFAULT 0x0056} [get_bd_cells AudioVoice_25]
create_bd_cell -type ip -vlnv utoronto.ca:user:AudioVoice:3.2 AudioVoice_26
set_property -dict {CONFIG.C_PITCH_DEFAULT 0x0056} [get_bd_cells AudioVoice_26]
create_bd_cell -type ip -vlnv utoronto.ca:user:AudioVoice:3.2 AudioVoice_27
set_property -dict {CONFIG.C_PITCH_DEFAULT 0x0056} [get_bd_cells AudioVoice_27]
create_bd_cell -type ip -vlnv utoronto.ca:user:AudioVoice:3.2 AudioVoice_28
set_property -dict {CONFIG.C_PITCH_DEFAULT 0x0056} [get_bd_cells AudioVoice_28]
create_bd_cell -type ip -vlnv utoronto.ca:user:AudioVoice:3.2 AudioVoice_29
set_property -dict {CONFIG.C_PITCH_DEFAULT 0x0056} [get_bd_cells AudioVoice_29]
create_bd_cell -type ip -vlnv utoronto.ca:user:AudioVoice:3.2 AudioVoice_30
set_property -dict {CONFIG.C_PITCH_DEFAULT 0x0056} [get_bd_cells AudioVoice_30]
create_bd_cell -type ip -vlnv utoronto.ca:user:AudioVoice:3.2 AudioVoice_31
set_property -dict {CONFIG.C_PITCH_DEFAULT 0x0056} [get_bd_cells AudioVoice_31]
create_bd_cell -type ip -vlnv utoronto.ca:user:mixer:1.0 mixer_15
set_property -dict {CONFIG.MODE true} [get_bd_cells mixer_15]
create_bd_cell -type ip -vlnv utoronto.ca:user:mixer:1.0 mixer_16
set_property -dict {CONFIG.MODE true} [get_bd_cells mixer_16]
create_bd_cell -type ip -vlnv utoronto.ca:user:mixer:1.0 mixer_17
set_property -dict {CONFIG.MODE true} [get_bd_cells mixer_17]
create_bd_cell -type ip -vlnv utoronto.ca:user:mixer:1.0 mixer_18
set_property -dict {CONFIG.MODE true} [get_bd_cells mixer_18]
create_bd_cell -type ip -vlnv utoronto.ca:user:mixer:1.0 mixer_19
set_property -dict {CONFIG.MODE true} [get_bd_cells mixer_19]
create_bd_cell -type ip -vlnv utoronto.ca:user:mixer:1.0 mixer_20
set_property -dict {CONFIG.MODE true} [get_bd_cells mixer_20]
create_bd_cell -type ip -vlnv utoronto.ca:user:mixer:1.0 mixer_21
set_property -dict {CONFIG.MODE true} [get_bd_cells mixer_21]
create_bd_cell -type ip -vlnv utoronto.ca:user:mixer:1.0 mixer_22
set_property -dict {CONFIG.MODE true} [get_bd_cells mixer_22]
create_bd_cell -type ip -vlnv utoronto.ca:user:mixer:1.0 mixer_23
set_property -dict {CONFIG.MODE true} [get_bd_cells mixer_23]
create_bd_cell -type ip -vlnv utoronto.ca:user:mixer:1.0 mixer_24
set_property -dict {CONFIG.MODE true} [get_bd_cells mixer_24]
create_bd_cell -type ip -vlnv utoronto.ca:user:mixer:1.0 mixer_25
set_property -dict {CONFIG.MODE true} [get_bd_cells mixer_25]
create_bd_cell -type ip -vlnv utoronto.ca:user:mixer:1.0 mixer_26
set_property -dict {CONFIG.MODE true} [get_bd_cells mixer_26]
create_bd_cell -type ip -vlnv utoronto.ca:user:mixer:1.0 mixer_27
set_property -dict {CONFIG.MODE true} [get_bd_cells mixer_27]
create_bd_cell -type ip -vlnv utoronto.ca:user:mixer:1.0 mixer_28
set_property -dict {CONFIG.MODE true} [get_bd_cells mixer_28]
create_bd_cell -type ip -vlnv utoronto.ca:user:mixer:1.0 mixer_29
set_property -dict {CONFIG.MODE true} [get_bd_cells mixer_29]
create_bd_cell -type ip -vlnv utoronto.ca:user:mixer:1.0 mixer_30
set_property -dict {CONFIG.MODE true} [get_bd_cells mixer_30]
create_bd_cell -type ip -vlnv xilinx.com:ip:axi_uartlite:2.0 axi_uartlite_0
create_bd_cell -type ip -vlnv digilentinc.com:IP:axi_ps2:1.0 axi_ps2_0
create_bd_cell -type ip -vlnv xilinx.com:ip:axi_gpio:2.0 mb_trigger_regs
set_property -dict {CONFIG.C_ALL_OUTPUTS 1} [get_bd_cells mb_trigger_regs]

# ---- hierarchy /microblaze_0_local_memory ----
current_bd_instance /microblaze_0_local_memory
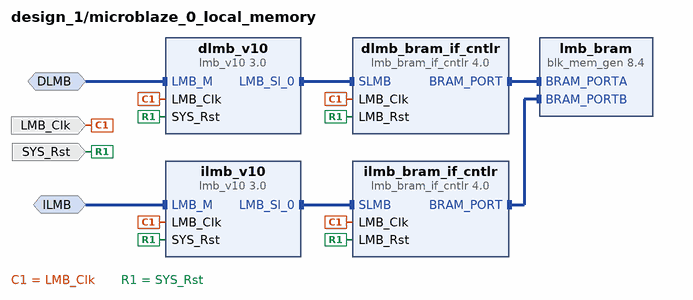
[diagram p9: block diagram inside /microblaze_0_local_memory]
create_bd_intf_pin -mode MirroredMaster -vlnv xilinx.com:interface:lmb_rtl:1.0 DLMB
create_bd_intf_pin -mode MirroredMaster -vlnv xilinx.com:interface:lmb_rtl:1.0 ILMB
create_bd_pin -dir I -type clk LMB_Clk
create_bd_pin -dir I -type rst SYS_Rst

create_bd_cell -type ip -vlnv xilinx.com:ip:lmb_v10:3.0 dlmb_v10
create_bd_cell -type ip -vlnv xilinx.com:ip:lmb_v10:3.0 ilmb_v10
create_bd_cell -type ip -vlnv xilinx.com:ip:lmb_bram_if_cntlr:4.0 dlmb_bram_if_cntlr
set_property -dict {CONFIG.C_ECC 0} [get_bd_cells dlmb_bram_if_cntlr]
create_bd_cell -type ip -vlnv xilinx.com:ip:lmb_bram_if_cntlr:4.0 ilmb_bram_if_cntlr
set_property -dict {CONFIG.C_ECC 0} [get_bd_cells ilmb_bram_if_cntlr]
create_bd_cell -type ip -vlnv xilinx.com:ip:blk_mem_gen:8.4 lmb_bram
set_property -dict {CONFIG.Memory_Type True_Dual_Port_RAM CONFIG.use_bram_block BRAM_Controller} [get_bd_cells lmb_bram]

# ---- connections ----

current_bd_instance /microblaze_0_local_memory
connect_bd_intf_net [get_bd_intf_pins dlmb_v10/LMB_Sl_0] [get_bd_intf_pins dlmb_bram_if_cntlr/SLMB]
connect_bd_intf_net [get_bd_intf_pins ilmb_v10/LMB_Sl_0] [get_bd_intf_pins ilmb_bram_if_cntlr/SLMB]
connect_bd_intf_net [get_bd_intf_pins ILMB] [get_bd_intf_pins ilmb_v10/LMB_M]
connect_bd_intf_net [get_bd_intf_pins dlmb_bram_if_cntlr/BRAM_PORT] [get_bd_intf_pins lmb_bram/BRAM_PORTA]
connect_bd_intf_net [get_bd_intf_pins DLMB] [get_bd_intf_pins dlmb_v10/LMB_M]
connect_bd_intf_net [get_bd_intf_pins ilmb_bram_if_cntlr/BRAM_PORT] [get_bd_intf_pins lmb_bram/BRAM_PORTB]
connect_bd_net -net microblaze_0_Clk [get_bd_pins LMB_Clk] \
  [get_bd_pins dlmb_v10/LMB_Clk] [get_bd_pins dlmb_bram_if_cntlr/LMB_Clk] [get_bd_pins ilmb_v10/LMB_Clk] \
  [get_bd_pins ilmb_bram_if_cntlr/LMB_Clk]
connect_bd_net [get_bd_pins SYS_Rst] \
  [get_bd_pins dlmb_v10/SYS_Rst] [get_bd_pins dlmb_bram_if_cntlr/LMB_Rst] [get_bd_pins ilmb_v10/SYS_Rst] \
  [get_bd_pins ilmb_bram_if_cntlr/LMB_Rst]
set_property HDL_ATTRIBUTE.BMM_INFO_ADDRESS_SPACE {byte  0x00000000 32 > design_1 microblaze_0_local_memory/lmb_bram} [get_bd_cells dlmb_bram_if_cntlr]
set_property HDL_ATTRIBUTE.KEEP_HIERARCHY yes [get_bd_cells dlmb_bram_if_cntlr]

current_bd_instance /
connect_bd_intf_net [get_bd_intf_ports PS2_Data_0] [get_bd_intf_pins axi_ps2_0/PS2_Data]
connect_bd_intf_net [get_bd_intf_pins microblaze_0_axi_periph/M45_AXI] [get_bd_intf_pins AudioVoice_23/S00_AXI]
connect_bd_intf_net [get_bd_intf_pins microblaze_0_axi_periph/M39_AXI] [get_bd_intf_pins Sequencer_17/S00_AXI]
connect_bd_intf_net [get_bd_intf_pins microblaze_0_axi_periph/M54_AXI] [get_bd_intf_pins axi_uartlite_0/S_AXI]
connect_bd_intf_net [get_bd_intf_pins microblaze_0_axi_periph/M56_AXI] [get_bd_intf_pins mb_trigger_regs/S_AXI]
connect_bd_intf_net [get_bd_intf_pins microblaze_0_axi_periph/M05_AXI] [get_bd_intf_pins AudioVoice_2/S00_AXI]
connect_bd_intf_net [get_bd_intf_ports PS2_Clk_0] [get_bd_intf_pins axi_ps2_0/PS2_Clk]
connect_bd_intf_net [get_bd_intf_pins microblaze_0_axi_periph/M52_AXI] [get_bd_intf_pins AudioVoice_30/S00_AXI]
connect_bd_intf_net [get_bd_intf_pins microblaze_0_axi_periph/M40_AXI] [get_bd_intf_pins AudioVoice_18/S00_AXI]
connect_bd_intf_net [get_bd_intf_pins microblaze_0_axi_periph/M31_AXI] [get_bd_intf_pins TempoGenerator_0/S00_AXI]
connect_bd_intf_net [get_bd_intf_pins microblaze_0_axi_periph/M42_AXI] [get_bd_intf_pins AudioVoice_20/S00_AXI]
connect_bd_intf_net [get_bd_intf_pins microblaze_0_axi_periph/M36_AXI] [get_bd_intf_pins Sequencer_14/S00_AXI]
connect_bd_intf_net [get_bd_intf_pins microblaze_0_axi_periph/M32_AXI] [get_bd_intf_pins AudioVoice_14/S00_AXI]
connect_bd_intf_net [get_bd_intf_pins AudioVoice_15/S00_AXI] [get_bd_intf_pins microblaze_0_axi_periph/M33_AXI]
connect_bd_intf_net [get_bd_intf_ports IIC_RTL] [get_bd_intf_pins axi_iic_0/IIC]
connect_bd_intf_net [get_bd_intf_pins microblaze_0_axi_periph/M21_AXI] [get_bd_intf_pins Sequencer_4/S00_AXI]
connect_bd_intf_net [get_bd_intf_pins microblaze_0_axi_periph/M44_AXI] [get_bd_intf_pins AudioVoice_22/S00_AXI]
connect_bd_intf_net [get_bd_intf_pins microblaze_0_axi_periph/M10_AXI] [get_bd_intf_pins AudioVoice_7/S00_AXI]
connect_bd_intf_net [get_bd_intf_pins microblaze_0_axi_periph/M49_AXI] [get_bd_intf_pins AudioVoice_27/S00_AXI]
connect_bd_intf_net [get_bd_intf_pins microblaze_0_axi_periph/M55_AXI] [get_bd_intf_pins axi_ps2_0/S_AXI]
connect_bd_intf_net [get_bd_intf_pins microblaze_0_axi_periph/M41_AXI] [get_bd_intf_pins AudioVoice_19/S00_AXI]
connect_bd_intf_net [get_bd_intf_pins microblaze_0_axi_periph/M06_AXI] [get_bd_intf_pins AudioVoice_3/S00_AXI]
connect_bd_intf_net [get_bd_intf_pins microblaze_0_axi_periph/M23_AXI] [get_bd_intf_pins Sequencer_6/S00_AXI]
connect_bd_intf_net [get_bd_intf_pins microblaze_0_axi_periph/M50_AXI] [get_bd_intf_pins AudioVoice_28/S00_AXI]
connect_bd_intf_net [get_bd_intf_pins microblaze_0_axi_periph/M03_AXI] [get_bd_intf_pins AudioVoice_0/S00_AXI]
connect_bd_intf_net [get_bd_intf_pins microblaze_0_axi_periph/M24_AXI] [get_bd_intf_pins Sequencer_7/S00_AXI]
connect_bd_intf_net [get_bd_intf_pins microblaze_0_axi_periph/M48_AXI] [get_bd_intf_pins AudioVoice_26/S00_AXI]
connect_bd_intf_net [get_bd_intf_pins microblaze_0_axi_periph/M26_AXI] [get_bd_intf_pins Sequencer_9/S00_AXI]
connect_bd_intf_net [get_bd_intf_pins Sequencer_13/S00_AXI] [get_bd_intf_pins microblaze_0_axi_periph/M30_AXI]
connect_bd_intf_net [get_bd_intf_pins microblaze_0_axi_periph/M43_AXI] [get_bd_intf_pins AudioVoice_21/S00_AXI]
connect_bd_intf_net [get_bd_intf_pins microblaze_0_axi_periph/M51_AXI] [get_bd_intf_pins AudioVoice_29/S00_AXI]
connect_bd_intf_net [get_bd_intf_pins microblaze_0_axi_periph/M07_AXI] [get_bd_intf_pins AudioVoice_4/S00_AXI]
connect_bd_intf_net [get_bd_intf_pins microblaze_0_axi_periph/M16_AXI] [get_bd_intf_pins AudioVoice_13/S00_AXI]
connect_bd_intf_net [get_bd_intf_pins microblaze_0_axi_periph/M28_AXI] [get_bd_intf_pins Sequencer_11/S00_AXI]
connect_bd_intf_net [get_bd_intf_pins AudioVoice_17/S00_AXI] [get_bd_intf_pins microblaze_0_axi_periph/M35_AXI]
connect_bd_intf_net [get_bd_intf_pins microblaze_0_axi_periph/M37_AXI] [get_bd_intf_pins Sequencer_15/S00_AXI]
connect_bd_intf_net [get_bd_intf_pins microblaze_0_axi_periph/M18_AXI] [get_bd_intf_pins Sequencer_1/S00_AXI]
connect_bd_intf_net [get_bd_intf_pins microblaze_0_axi_periph/M46_AXI] [get_bd_intf_pins AudioVoice_24/S00_AXI]
connect_bd_intf_net [get_bd_intf_pins microblaze_0_axi_periph/M01_AXI] [get_bd_intf_pins axi_iic_0/S_AXI]
connect_bd_intf_net [get_bd_intf_pins microblaze_0_axi_periph/M27_AXI] [get_bd_intf_pins Sequencer_10/S00_AXI]
connect_bd_intf_net [get_bd_intf_ports usb_uart] [get_bd_intf_pins axi_uartlite_0/UART]
connect_bd_intf_net [get_bd_intf_pins microblaze_0_axi_periph/M53_AXI] [get_bd_intf_pins AudioVoice_31/S00_AXI]
connect_bd_intf_net [get_bd_intf_pins microblaze_0_axi_periph/M47_AXI] [get_bd_intf_pins AudioVoice_25/S00_AXI]
connect_bd_intf_net [get_bd_intf_pins microblaze_0_axi_periph/M22_AXI] [get_bd_intf_pins Sequencer_5/S00_AXI]
connect_bd_intf_net [get_bd_intf_pins microblaze_0_axi_periph/M14_AXI] [get_bd_intf_pins AudioVoice_11/S00_AXI]
connect_bd_intf_net [get_bd_intf_pins microblaze_0/DLMB] [get_bd_intf_pins microblaze_0_local_memory/DLMB]
connect_bd_intf_net [get_bd_intf_pins sample_to_audio_stre_0/m00_axis_aud] [get_bd_intf_pins i2s_transmitter_0/s_axis_aud]
connect_bd_intf_net [get_bd_intf_pins sample_to_audio_stre_0/m00_axis_aud] [get_bd_intf_pins system_ila_1/SLOT_0_AXIS]
connect_bd_intf_net [get_bd_intf_pins microblaze_0_axi_periph/M02_AXI] [get_bd_intf_pins i2s_transmitter_0/s_axi_ctrl]
connect_bd_intf_net [get_bd_intf_pins microblaze_0_axi_periph/M20_AXI] [get_bd_intf_pins Sequencer_3/S00_AXI]
connect_bd_intf_net [get_bd_intf_pins microblaze_0_axi_periph/M11_AXI] [get_bd_intf_pins AudioVoice_8/S00_AXI]
connect_bd_intf_net [get_bd_intf_pins microblaze_0_axi_periph/M00_AXI] [get_bd_intf_pins microblaze_0_axi_intc/s_axi]
connect_bd_intf_net [get_bd_intf_pins microblaze_0_axi_periph/S00_AXI] [get_bd_intf_pins microblaze_0/M_AXI_DP]
connect_bd_intf_net [get_bd_intf_pins microblaze_0_axi_intc/interrupt] [get_bd_intf_pins microblaze_0/INTERRUPT]
connect_bd_intf_net [get_bd_intf_pins microblaze_0_axi_periph/M13_AXI] [get_bd_intf_pins AudioVoice_10/S00_AXI]
connect_bd_intf_net [get_bd_intf_pins microblaze_0_axi_periph/M15_AXI] [get_bd_intf_pins AudioVoice_12/S00_AXI]
connect_bd_intf_net [get_bd_intf_pins microblaze_0_axi_periph/M25_AXI] [get_bd_intf_pins Sequencer_8/S00_AXI]
connect_bd_intf_net [get_bd_intf_pins microblaze_0_axi_periph/M12_AXI] [get_bd_intf_pins AudioVoice_9/S00_AXI]
connect_bd_intf_net [get_bd_intf_pins microblaze_0_axi_periph/M29_AXI] [get_bd_intf_pins Sequencer_12/S00_AXI]
connect_bd_intf_net [get_bd_intf_pins mdm_1/MBDEBUG_0] [get_bd_intf_pins microblaze_0/DEBUG]
connect_bd_intf_net [get_bd_intf_pins AudioVoice_16/S00_AXI] [get_bd_intf_pins microblaze_0_axi_periph/M34_AXI]
connect_bd_intf_net [get_bd_intf_pins AudioVoice_6/S00_AXI] [get_bd_intf_pins microblaze_0_axi_periph/M09_AXI]
connect_bd_intf_net [get_bd_intf_pins microblaze_0_axi_periph/M19_AXI] [get_bd_intf_pins Sequencer_2/S00_AXI]
connect_bd_intf_net [get_bd_intf_pins microblaze_0_axi_periph/M38_AXI] [get_bd_intf_pins Sequencer_16/S00_AXI]
connect_bd_intf_net [get_bd_intf_pins microblaze_0_axi_periph/M04_AXI] [get_bd_intf_pins AudioVoice_1/S00_AXI]
connect_bd_intf_net [get_bd_intf_pins microblaze_0_axi_periph/M17_AXI] [get_bd_intf_pins Sequencer_0/S00_AXI]
connect_bd_intf_net [get_bd_intf_pins microblaze_0_axi_periph/M08_AXI] [get_bd_intf_pins AudioVoice_5/S00_AXI]
connect_bd_intf_net [get_bd_intf_pins microblaze_0/ILMB] [get_bd_intf_pins microblaze_0_local_memory/ILMB]
connect_bd_net -net microblaze_0_Clk [get_bd_pins clk_wiz_1/clk_out1] \
  [get_bd_pins microblaze_0/Clk] [get_bd_pins microblaze_0_axi_periph/ACLK] [get_bd_pins microblaze_0_axi_periph/S00_ACLK] \
  [get_bd_pins microblaze_0_axi_periph/M00_ACLK] [get_bd_pins microblaze_0_axi_intc/s_axi_aclk] \
  [get_bd_pins microblaze_0_axi_intc/processor_clk] [get_bd_pins microblaze_0_local_memory/LMB_Clk] \
  [get_bd_pins rst_clk_wiz_1_100M/slowest_sync_clk] [get_bd_pins axi_iic_0/s_axi_aclk] \
  [get_bd_pins microblaze_0_axi_periph/M01_ACLK] [get_bd_pins i2s_transmitter_0/s_axi_ctrl_aclk] \
  [get_bd_pins microblaze_0_axi_periph/M02_ACLK] [get_bd_pins microblaze_0_axi_periph/M03_ACLK] \
  [get_bd_pins i2s_transmitter_0/s_axis_aud_aclk] [get_bd_pins system_ila_1/clk] \
  [get_bd_pins microblaze_0_axi_periph/M04_ACLK] [get_bd_pins microblaze_0_axi_periph/M05_ACLK] \
  [get_bd_pins microblaze_0_axi_periph/M06_ACLK] [get_bd_pins microblaze_0_axi_periph/M07_ACLK] \
  [get_bd_pins microblaze_0_axi_periph/M08_ACLK] [get_bd_pins microblaze_0_axi_periph/M09_ACLK] \
  [get_bd_pins microblaze_0_axi_periph/M10_ACLK] [get_bd_pins microblaze_0_axi_periph/M11_ACLK] \
  [get_bd_pins microblaze_0_axi_periph/M12_ACLK] [get_bd_pins microblaze_0_axi_periph/M13_ACLK] \
  [get_bd_pins microblaze_0_axi_periph/M14_ACLK] [get_bd_pins microblaze_0_axi_periph/M15_ACLK] \
  [get_bd_pins microblaze_0_axi_periph/M16_ACLK] [get_bd_pins microblaze_0_axi_periph/M17_ACLK] \
  [get_bd_pins microblaze_0_axi_periph/M18_ACLK] [get_bd_pins microblaze_0_axi_periph/M19_ACLK] \
  [get_bd_pins microblaze_0_axi_periph/M20_ACLK] [get_bd_pins microblaze_0_axi_periph/M21_ACLK] \
  [get_bd_pins microblaze_0_axi_periph/M22_ACLK] [get_bd_pins microblaze_0_axi_periph/M23_ACLK] \
  [get_bd_pins microblaze_0_axi_periph/M24_ACLK] [get_bd_pins microblaze_0_axi_periph/M25_ACLK] \
  [get_bd_pins microblaze_0_axi_periph/M26_ACLK] [get_bd_pins microblaze_0_axi_periph/M27_ACLK] \
  [get_bd_pins microblaze_0_axi_periph/M28_ACLK] [get_bd_pins microblaze_0_axi_periph/M29_ACLK] \
  [get_bd_pins microblaze_0_axi_periph/M30_ACLK] [get_bd_pins microblaze_0_axi_periph/M31_ACLK] \
  [get_bd_pins microblaze_0_axi_periph/M32_ACLK] [get_bd_pins microblaze_0_axi_periph/M33_ACLK] \
  [get_bd_pins microblaze_0_axi_periph/M34_ACLK] [get_bd_pins microblaze_0_axi_periph/M35_ACLK] \
  [get_bd_pins microblaze_0_axi_periph/M36_ACLK] [get_bd_pins microblaze_0_axi_periph/M37_ACLK] \
  [get_bd_pins microblaze_0_axi_periph/M38_ACLK] [get_bd_pins microblaze_0_axi_periph/M39_ACLK] \
  [get_bd_pins Sequencer_0/fast_clk] [get_bd_pins Sequencer_0/s00_axi_aclk] [get_bd_pins Sequencer_1/fast_clk] \
  [get_bd_pins Sequencer_1/s00_axi_aclk] [get_bd_pins Sequencer_14/fast_clk] [get_bd_pins Sequencer_14/s00_axi_aclk] \
  [get_bd_pins Sequencer_11/fast_clk] [get_bd_pins Sequencer_11/s00_axi_aclk] [get_bd_pins Sequencer_12/fast_clk] \
  [get_bd_pins Sequencer_12/s00_axi_aclk] [get_bd_pins Sequencer_13/fast_clk] [get_bd_pins Sequencer_13/s00_axi_aclk] \
  [get_bd_pins Sequencer_15/fast_clk] [get_bd_pins Sequencer_15/s00_axi_aclk] [get_bd_pins Sequencer_16/fast_clk] \
  [get_bd_pins Sequencer_16/s00_axi_aclk] [get_bd_pins Sequencer_17/fast_clk] [get_bd_pins Sequencer_17/s00_axi_aclk] \
  [get_bd_pins Sequencer_2/fast_clk] [get_bd_pins Sequencer_2/s00_axi_aclk] [get_bd_pins Sequencer_3/fast_clk] \
  [get_bd_pins Sequencer_3/s00_axi_aclk] [get_bd_pins Sequencer_4/fast_clk] [get_bd_pins Sequencer_4/s00_axi_aclk] \
  [get_bd_pins Sequencer_5/fast_clk] [get_bd_pins Sequencer_5/s00_axi_aclk] [get_bd_pins Sequencer_8/fast_clk] \
  [get_bd_pins Sequencer_8/s00_axi_aclk] [get_bd_pins Sequencer_6/fast_clk] [get_bd_pins Sequencer_6/s00_axi_aclk] \
  [get_bd_pins Sequencer_7/fast_clk] [get_bd_pins Sequencer_7/s00_axi_aclk] [get_bd_pins Sequencer_9/fast_clk] \
  [get_bd_pins Sequencer_9/s00_axi_aclk] [get_bd_pins Sequencer_10/fast_clk] [get_bd_pins Sequencer_10/s00_axi_aclk] \
  [get_bd_pins AudioVoice_0/fast_clk] [get_bd_pins AudioVoice_0/s00_axi_aclk] [get_bd_pins AudioVoice_12/fast_clk] \
  [get_bd_pins AudioVoice_12/s00_axi_aclk] [get_bd_pins AudioVoice_13/fast_clk] [get_bd_pins AudioVoice_13/s00_axi_aclk] \
  [get_bd_pins AudioVoice_14/fast_clk] [get_bd_pins AudioVoice_14/s00_axi_aclk] [get_bd_pins AudioVoice_15/fast_clk] \
  [get_bd_pins AudioVoice_15/s00_axi_aclk] [get_bd_pins AudioVoice_16/fast_clk] [get_bd_pins AudioVoice_16/s00_axi_aclk] \
  [get_bd_pins AudioVoice_17/fast_clk] [get_bd_pins AudioVoice_17/s00_axi_aclk] [get_bd_pins AudioVoice_1/fast_clk] \
  [get_bd_pins AudioVoice_1/s00_axi_aclk] [get_bd_pins AudioVoice_2/fast_clk] [get_bd_pins AudioVoice_2/s00_axi_aclk] \
  [get_bd_pins AudioVoice_3/fast_clk] [get_bd_pins AudioVoice_3/s00_axi_aclk] [get_bd_pins AudioVoice_4/fast_clk] \
  [get_bd_pins AudioVoice_4/s00_axi_aclk] [get_bd_pins AudioVoice_6/fast_clk] [get_bd_pins AudioVoice_6/s00_axi_aclk] \
  [get_bd_pins AudioVoice_5/fast_clk] [get_bd_pins AudioVoice_5/s00_axi_aclk] [get_bd_pins AudioVoice_7/fast_clk] \
  [get_bd_pins AudioVoice_7/s00_axi_aclk] [get_bd_pins AudioVoice_8/fast_clk] [get_bd_pins AudioVoice_8/s00_axi_aclk] \
  [get_bd_pins AudioVoice_9/fast_clk] [get_bd_pins AudioVoice_9/s00_axi_aclk] [get_bd_pins AudioVoice_10/fast_clk] \
  [get_bd_pins AudioVoice_10/s00_axi_aclk] [get_bd_pins AudioVoice_11/fast_clk] [get_bd_pins AudioVoice_11/s00_axi_aclk] \
  [get_bd_pins TempoGenerator_0/clk] [get_bd_pins TempoGenerator_0/s00_axi_aclk] \
  [get_bd_pins sample_to_audio_stre_0/m00_axis_aud_aclk] [get_bd_pins AudioPulseGen_0/clk] [get_bd_pins mixer_0/clk] \
  [get_bd_pins mixer_1/clk] [get_bd_pins mixer_2/clk] [get_bd_pins mixer_3/clk] [get_bd_pins mixer_4/clk] \
  [get_bd_pins mixer_5/clk] [get_bd_pins mixer_6/clk] [get_bd_pins mixer_7/clk] [get_bd_pins mixer_8/clk] \
  [get_bd_pins mixer_9/clk] [get_bd_pins mixer_10/clk] [get_bd_pins mixer_11/clk] [get_bd_pins mixer_12/clk] \
  [get_bd_pins mixer_13/clk] [get_bd_pins mixer_14/clk] [get_bd_pins microblaze_0_axi_periph/M40_ACLK] \
  [get_bd_pins AudioVoice_18/s00_axi_aclk] [get_bd_pins microblaze_0_axi_periph/M41_ACLK] \
  [get_bd_pins AudioVoice_19/s00_axi_aclk] [get_bd_pins microblaze_0_axi_periph/M42_ACLK] \
  [get_bd_pins AudioVoice_20/s00_axi_aclk] [get_bd_pins microblaze_0_axi_periph/M43_ACLK] \
  [get_bd_pins AudioVoice_21/s00_axi_aclk] [get_bd_pins microblaze_0_axi_periph/M44_ACLK] \
  [get_bd_pins AudioVoice_22/s00_axi_aclk] [get_bd_pins microblaze_0_axi_periph/M45_ACLK] \
  [get_bd_pins AudioVoice_23/s00_axi_aclk] [get_bd_pins microblaze_0_axi_periph/M46_ACLK] \
  [get_bd_pins AudioVoice_24/s00_axi_aclk] [get_bd_pins microblaze_0_axi_periph/M47_ACLK] \
  [get_bd_pins AudioVoice_25/s00_axi_aclk] [get_bd_pins microblaze_0_axi_periph/M48_ACLK] \
  [get_bd_pins AudioVoice_26/s00_axi_aclk] [get_bd_pins microblaze_0_axi_periph/M49_ACLK] \
  [get_bd_pins AudioVoice_27/s00_axi_aclk] [get_bd_pins microblaze_0_axi_periph/M50_ACLK] \
  [get_bd_pins AudioVoice_28/s00_axi_aclk] [get_bd_pins microblaze_0_axi_periph/M51_ACLK] \
  [get_bd_pins AudioVoice_29/s00_axi_aclk] [get_bd_pins microblaze_0_axi_periph/M52_ACLK] \
  [get_bd_pins AudioVoice_30/s00_axi_aclk] [get_bd_pins microblaze_0_axi_periph/M53_ACLK] \
  [get_bd_pins AudioVoice_31/s00_axi_aclk] [get_bd_pins AudioVoice_18/fast_clk] [get_bd_pins AudioVoice_19/fast_clk] \
  [get_bd_pins AudioVoice_20/fast_clk] [get_bd_pins AudioVoice_21/fast_clk] [get_bd_pins AudioVoice_22/fast_clk] \
  [get_bd_pins AudioVoice_23/fast_clk] [get_bd_pins AudioVoice_24/fast_clk] [get_bd_pins AudioVoice_25/fast_clk] \
  [get_bd_pins AudioVoice_26/fast_clk] [get_bd_pins AudioVoice_27/fast_clk] [get_bd_pins AudioVoice_28/fast_clk] \
  [get_bd_pins AudioVoice_29/fast_clk] [get_bd_pins AudioVoice_30/fast_clk] [get_bd_pins AudioVoice_31/fast_clk] \
  [get_bd_pins mixer_15/clk] [get_bd_pins mixer_16/clk] [get_bd_pins mixer_17/clk] [get_bd_pins mixer_18/clk] \
  [get_bd_pins mixer_19/clk] [get_bd_pins mixer_20/clk] [get_bd_pins mixer_21/clk] [get_bd_pins mixer_22/clk] \
  [get_bd_pins mixer_23/clk] [get_bd_pins mixer_24/clk] [get_bd_pins mixer_25/clk] [get_bd_pins mixer_26/clk] \
  [get_bd_pins mixer_27/clk] [get_bd_pins mixer_28/clk] [get_bd_pins mixer_29/clk] [get_bd_pins mixer_30/clk] \
  [get_bd_pins microblaze_0_axi_periph/M54_ACLK] [get_bd_pins axi_uartlite_0/s_axi_aclk] \
  [get_bd_pins microblaze_0_axi_periph/M55_ACLK] [get_bd_pins axi_ps2_0/S_AXI_aclk] \
  [get_bd_pins microblaze_0_axi_periph/M56_ACLK] [get_bd_pins mb_trigger_regs/s_axi_aclk]
connect_bd_net [get_bd_pins clk_wiz_1/locked] [get_bd_pins rst_clk_wiz_1_100M/dcm_locked] [get_bd_pins rst_clk_wiz_1_12M/dcm_locked]
connect_bd_net [get_bd_pins rst_clk_wiz_1_100M/mb_reset] [get_bd_pins microblaze_0/Reset] [get_bd_pins microblaze_0_axi_intc/processor_rst]
connect_bd_net [get_bd_pins rst_clk_wiz_1_100M/bus_struct_reset] [get_bd_pins microblaze_0_local_memory/SYS_Rst]
connect_bd_net [get_bd_pins rst_clk_wiz_1_100M/peripheral_aresetn] \
  [get_bd_pins microblaze_0_axi_periph/S00_ARESETN] [get_bd_pins microblaze_0_axi_periph/M00_ARESETN] \
  [get_bd_pins microblaze_0_axi_intc/s_axi_aresetn] [get_bd_pins axi_iic_0/s_axi_aresetn] \
  [get_bd_pins microblaze_0_axi_periph/M01_ARESETN] [get_bd_pins i2s_transmitter_0/s_axi_ctrl_aresetn] \
  [get_bd_pins microblaze_0_axi_periph/M02_ARESETN] [get_bd_pins microblaze_0_axi_periph/M03_ARESETN] \
  [get_bd_pins i2s_transmitter_0/s_axis_aud_aresetn] [get_bd_pins system_ila_1/resetn] \
  [get_bd_pins microblaze_0_axi_periph/M04_ARESETN] [get_bd_pins microblaze_0_axi_periph/M05_ARESETN] \
  [get_bd_pins microblaze_0_axi_periph/M06_ARESETN] [get_bd_pins microblaze_0_axi_periph/M07_ARESETN] \
  [get_bd_pins microblaze_0_axi_periph/M08_ARESETN] [get_bd_pins microblaze_0_axi_periph/M09_ARESETN] \
  [get_bd_pins microblaze_0_axi_periph/M10_ARESETN] [get_bd_pins microblaze_0_axi_periph/M11_ARESETN] \
  [get_bd_pins microblaze_0_axi_periph/M12_ARESETN] [get_bd_pins microblaze_0_axi_periph/M13_ARESETN] \
  [get_bd_pins microblaze_0_axi_periph/M14_ARESETN] [get_bd_pins microblaze_0_axi_periph/M15_ARESETN] \
  [get_bd_pins microblaze_0_axi_periph/M16_ARESETN] [get_bd_pins microblaze_0_axi_periph/M17_ARESETN] \
  [get_bd_pins microblaze_0_axi_periph/M18_ARESETN] [get_bd_pins microblaze_0_axi_periph/M19_ARESETN] \
  [get_bd_pins microblaze_0_axi_periph/M20_ARESETN] [get_bd_pins microblaze_0_axi_periph/M21_ARESETN] \
  [get_bd_pins microblaze_0_axi_periph/M22_ARESETN] [get_bd_pins microblaze_0_axi_periph/M23_ARESETN] \
  [get_bd_pins microblaze_0_axi_periph/M24_ARESETN] [get_bd_pins microblaze_0_axi_periph/M25_ARESETN] \
  [get_bd_pins microblaze_0_axi_periph/M26_ARESETN] [get_bd_pins microblaze_0_axi_periph/M27_ARESETN] \
  [get_bd_pins microblaze_0_axi_periph/M28_ARESETN] [get_bd_pins microblaze_0_axi_periph/M29_ARESETN] \
  [get_bd_pins microblaze_0_axi_periph/M30_ARESETN] [get_bd_pins microblaze_0_axi_periph/M31_ARESETN] \
  [get_bd_pins microblaze_0_axi_periph/M32_ARESETN] [get_bd_pins microblaze_0_axi_periph/M33_ARESETN] \
  [get_bd_pins microblaze_0_axi_periph/M34_ARESETN] [get_bd_pins microblaze_0_axi_periph/M35_ARESETN] \
  [get_bd_pins microblaze_0_axi_periph/M36_ARESETN] [get_bd_pins microblaze_0_axi_periph/M37_ARESETN] \
  [get_bd_pins microblaze_0_axi_periph/M38_ARESETN] [get_bd_pins microblaze_0_axi_periph/M39_ARESETN] \
  [get_bd_pins Sequencer_0/resetn] [get_bd_pins Sequencer_0/s00_axi_aresetn] [get_bd_pins Sequencer_1/resetn] \
  [get_bd_pins Sequencer_1/s00_axi_aresetn] [get_bd_pins Sequencer_14/resetn] [get_bd_pins Sequencer_14/s00_axi_aresetn] \
  [get_bd_pins Sequencer_11/resetn] [get_bd_pins Sequencer_11/s00_axi_aresetn] [get_bd_pins Sequencer_12/resetn] \
  [get_bd_pins Sequencer_12/s00_axi_aresetn] [get_bd_pins Sequencer_13/resetn] [get_bd_pins Sequencer_13/s00_axi_aresetn] \
  [get_bd_pins Sequencer_15/resetn] [get_bd_pins Sequencer_15/s00_axi_aresetn] [get_bd_pins Sequencer_16/resetn] \
  [get_bd_pins Sequencer_16/s00_axi_aresetn] [get_bd_pins Sequencer_17/resetn] [get_bd_pins Sequencer_17/s00_axi_aresetn] \
  [get_bd_pins Sequencer_2/resetn] [get_bd_pins Sequencer_2/s00_axi_aresetn] [get_bd_pins Sequencer_3/resetn] \
  [get_bd_pins Sequencer_3/s00_axi_aresetn] [get_bd_pins Sequencer_4/resetn] [get_bd_pins Sequencer_4/s00_axi_aresetn] \
  [get_bd_pins Sequencer_5/resetn] [get_bd_pins Sequencer_5/s00_axi_aresetn] [get_bd_pins Sequencer_8/resetn] \
  [get_bd_pins Sequencer_8/s00_axi_aresetn] [get_bd_pins Sequencer_6/resetn] [get_bd_pins Sequencer_6/s00_axi_aresetn] \
  [get_bd_pins Sequencer_7/resetn] [get_bd_pins Sequencer_7/s00_axi_aresetn] [get_bd_pins Sequencer_9/resetn] \
  [get_bd_pins Sequencer_9/s00_axi_aresetn] [get_bd_pins Sequencer_10/resetn] [get_bd_pins Sequencer_10/s00_axi_aresetn] \
  [get_bd_pins AudioVoice_0/resetn] [get_bd_pins AudioVoice_0/s00_axi_aresetn] [get_bd_pins AudioVoice_12/resetn] \
  [get_bd_pins AudioVoice_12/s00_axi_aresetn] [get_bd_pins AudioVoice_13/resetn] [get_bd_pins AudioVoice_13/s00_axi_aresetn] \
  [get_bd_pins AudioVoice_14/resetn] [get_bd_pins AudioVoice_14/s00_axi_aresetn] [get_bd_pins AudioVoice_15/resetn] \
  [get_bd_pins AudioVoice_15/s00_axi_aresetn] [get_bd_pins AudioVoice_16/resetn] [get_bd_pins AudioVoice_16/s00_axi_aresetn] \
  [get_bd_pins AudioVoice_17/resetn] [get_bd_pins AudioVoice_17/s00_axi_aresetn] [get_bd_pins AudioVoice_1/resetn] \
  [get_bd_pins AudioVoice_1/s00_axi_aresetn] [get_bd_pins AudioVoice_2/resetn] [get_bd_pins AudioVoice_2/s00_axi_aresetn] \
  [get_bd_pins AudioVoice_3/resetn] [get_bd_pins AudioVoice_3/s00_axi_aresetn] [get_bd_pins AudioVoice_4/resetn] \
  [get_bd_pins AudioVoice_4/s00_axi_aresetn] [get_bd_pins AudioVoice_6/resetn] [get_bd_pins AudioVoice_6/s00_axi_aresetn] \
  [get_bd_pins AudioVoice_5/resetn] [get_bd_pins AudioVoice_5/s00_axi_aresetn] [get_bd_pins AudioVoice_7/resetn] \
  [get_bd_pins AudioVoice_7/s00_axi_aresetn] [get_bd_pins AudioVoice_8/resetn] [get_bd_pins AudioVoice_8/s00_axi_aresetn] \
  [get_bd_pins AudioVoice_9/resetn] [get_bd_pins AudioVoice_9/s00_axi_aresetn] [get_bd_pins AudioVoice_10/resetn] \
  [get_bd_pins AudioVoice_10/s00_axi_aresetn] [get_bd_pins AudioVoice_11/resetn] [get_bd_pins AudioVoice_11/s00_axi_aresetn] \
  [get_bd_pins TempoGenerator_0/resetn] [get_bd_pins TempoGenerator_0/s00_axi_aresetn] \
  [get_bd_pins sample_to_audio_stre_0/m00_axis_aud_aresetn] [get_bd_pins mixer_0/resetn] [get_bd_pins mixer_1/resetn] \
  [get_bd_pins mixer_2/resetn] [get_bd_pins mixer_3/resetn] [get_bd_pins mixer_4/resetn] [get_bd_pins mixer_5/resetn] \
  [get_bd_pins mixer_6/resetn] [get_bd_pins mixer_7/resetn] [get_bd_pins mixer_8/resetn] [get_bd_pins mixer_9/resetn] \
  [get_bd_pins mixer_10/resetn] [get_bd_pins mixer_11/resetn] [get_bd_pins mixer_12/resetn] [get_bd_pins mixer_13/resetn] \
  [get_bd_pins mixer_14/resetn] [get_bd_pins microblaze_0_axi_periph/M40_ARESETN] [get_bd_pins AudioVoice_18/s00_axi_aresetn] \
  [get_bd_pins microblaze_0_axi_periph/M41_ARESETN] [get_bd_pins AudioVoice_19/s00_axi_aresetn] \
  [get_bd_pins microblaze_0_axi_periph/M42_ARESETN] [get_bd_pins AudioVoice_20/s00_axi_aresetn] \
  [get_bd_pins microblaze_0_axi_periph/M43_ARESETN] [get_bd_pins AudioVoice_21/s00_axi_aresetn] \
  [get_bd_pins microblaze_0_axi_periph/M44_ARESETN] [get_bd_pins AudioVoice_22/s00_axi_aresetn] \
  [get_bd_pins microblaze_0_axi_periph/M45_ARESETN] [get_bd_pins AudioVoice_23/s00_axi_aresetn] \
  [get_bd_pins microblaze_0_axi_periph/M46_ARESETN] [get_bd_pins AudioVoice_24/s00_axi_aresetn] \
  [get_bd_pins microblaze_0_axi_periph/M47_ARESETN] [get_bd_pins AudioVoice_25/s00_axi_aresetn] \
  [get_bd_pins microblaze_0_axi_periph/M48_ARESETN] [get_bd_pins AudioVoice_26/s00_axi_aresetn] \
  [get_bd_pins microblaze_0_axi_periph/M49_ARESETN] [get_bd_pins AudioVoice_27/s00_axi_aresetn] \
  [get_bd_pins microblaze_0_axi_periph/M50_ARESETN] [get_bd_pins AudioVoice_28/s00_axi_aresetn] \
  [get_bd_pins microblaze_0_axi_periph/M51_ARESETN] [get_bd_pins AudioVoice_29/s00_axi_aresetn] \
  [get_bd_pins microblaze_0_axi_periph/M52_ARESETN] [get_bd_pins AudioVoice_30/s00_axi_aresetn] \
  [get_bd_pins microblaze_0_axi_periph/M53_ARESETN] [get_bd_pins AudioVoice_31/s00_axi_aresetn] [get_bd_pins mixer_15/resetn] \
  [get_bd_pins mixer_16/resetn] [get_bd_pins mixer_17/resetn] [get_bd_pins mixer_18/resetn] [get_bd_pins mixer_19/resetn] \
  [get_bd_pins mixer_20/resetn] [get_bd_pins mixer_21/resetn] [get_bd_pins mixer_22/resetn] [get_bd_pins mixer_23/resetn] \
  [get_bd_pins mixer_24/resetn] [get_bd_pins mixer_25/resetn] [get_bd_pins mixer_26/resetn] [get_bd_pins mixer_27/resetn] \
  [get_bd_pins mixer_28/resetn] [get_bd_pins mixer_29/resetn] [get_bd_pins mixer_30/resetn] \
  [get_bd_pins AudioVoice_18/resetn] [get_bd_pins AudioVoice_19/resetn] [get_bd_pins AudioVoice_20/resetn] \
  [get_bd_pins AudioVoice_21/resetn] [get_bd_pins AudioVoice_22/resetn] [get_bd_pins AudioVoice_23/resetn] \
  [get_bd_pins AudioVoice_24/resetn] [get_bd_pins AudioVoice_25/resetn] [get_bd_pins AudioVoice_26/resetn] \
  [get_bd_pins AudioVoice_27/resetn] [get_bd_pins AudioVoice_28/resetn] [get_bd_pins AudioVoice_29/resetn] \
  [get_bd_pins AudioVoice_30/resetn] [get_bd_pins AudioVoice_31/resetn] [get_bd_pins microblaze_0_axi_periph/M54_ARESETN] \
  [get_bd_pins axi_uartlite_0/s_axi_aresetn] [get_bd_pins microblaze_0_axi_periph/M55_ARESETN] \
  [get_bd_pins axi_ps2_0/S_AXI_aresetn] [get_bd_pins microblaze_0_axi_periph/M56_ARESETN] \
  [get_bd_pins mb_trigger_regs/s_axi_aresetn]
connect_bd_net [get_bd_pins mdm_1/Debug_SYS_Rst] [get_bd_pins rst_clk_wiz_1_100M/mb_debug_sys_rst]
connect_bd_net [get_bd_ports RESET] \
  [get_bd_pins clk_wiz_1/resetn] [get_bd_pins rst_clk_wiz_1_100M/ext_reset_in] [get_bd_pins rst_clk_wiz_1_12M/ext_reset_in]
connect_bd_net [get_bd_ports SYSCLK] [get_bd_pins clk_wiz_1/clk_in1]
connect_bd_net [get_bd_pins clk_wiz_1/clk_out2] \
  [get_bd_pins i2s_transmitter_0/aud_mclk] [get_bd_pins rst_clk_wiz_1_12M/slowest_sync_clk] [get_bd_ports MCLK]
connect_bd_net [get_bd_pins rst_clk_wiz_1_12M/peripheral_reset] [get_bd_pins i2s_transmitter_0/aud_mrst]
connect_bd_net [get_bd_pins i2s_transmitter_0/lrclk_out] [get_bd_ports LRCLK] [get_bd_pins AudioPulseGen_0/audio_clk]
connect_bd_net [get_bd_pins i2s_transmitter_0/sclk_out] [get_bd_ports BCLK]
connect_bd_net [get_bd_pins i2s_transmitter_0/sdata_0_out] [get_bd_ports DATA_O]
connect_bd_net -net ARESETN_1 [get_bd_pins rst_clk_wiz_1_100M/interconnect_aresetn] [get_bd_pins microblaze_0_axi_periph/ARESETN]
connect_bd_net [get_bd_pins TempoGenerator_0/tempo_pulse] \
  [get_bd_pins Sequencer_0/tempo_pulse] [get_bd_pins Sequencer_1/tempo_pulse] [get_bd_pins Sequencer_14/tempo_pulse] \
  [get_bd_pins Sequencer_11/tempo_pulse] [get_bd_pins Sequencer_12/tempo_pulse] [get_bd_pins Sequencer_13/tempo_pulse] \
  [get_bd_pins Sequencer_15/tempo_pulse] [get_bd_pins Sequencer_16/tempo_pulse] [get_bd_pins Sequencer_17/tempo_pulse] \
  [get_bd_pins Sequencer_2/tempo_pulse] [get_bd_pins Sequencer_3/tempo_pulse] [get_bd_pins Sequencer_4/tempo_pulse] \
  [get_bd_pins Sequencer_5/tempo_pulse] [get_bd_pins Sequencer_8/tempo_pulse] [get_bd_pins Sequencer_6/tempo_pulse] \
  [get_bd_pins Sequencer_7/tempo_pulse] [get_bd_pins Sequencer_9/tempo_pulse] [get_bd_pins Sequencer_10/tempo_pulse]
connect_bd_net [get_bd_pins Sequencer_0/trigger] [get_bd_ports sequencer_0_output]
connect_bd_net [get_bd_pins Sequencer_1/trigger] [get_bd_ports sequencer_1_output]
connect_bd_net [get_bd_pins Sequencer_2/trigger] [get_bd_ports sequencer_2_output]
connect_bd_net [get_bd_pins Sequencer_3/trigger] [get_bd_ports sequencer_3_output]
connect_bd_net [get_bd_pins Sequencer_4/trigger] [get_bd_ports sequencer_4_output]
connect_bd_net [get_bd_pins Sequencer_5/trigger] [get_bd_ports sequencer_5_output]
